# Altium project Air Quality Monitor.PrjPcb (part 1 of 2)
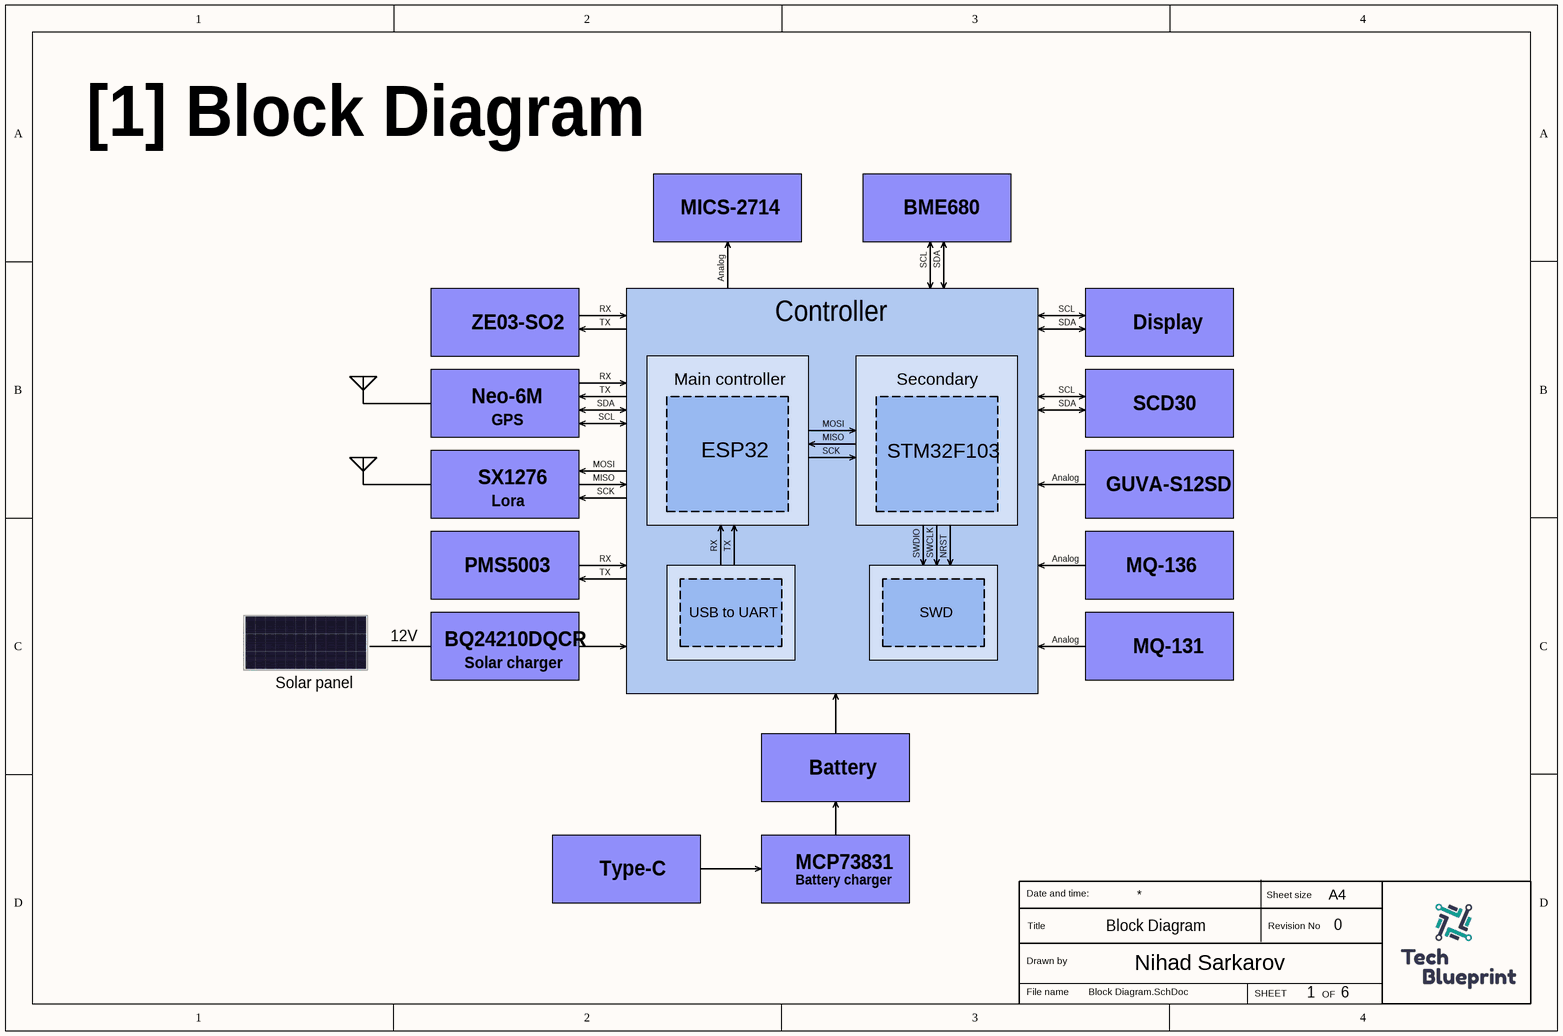
[diagram p0: Block Diagram.SchDoc]
5 sheets, 132 parts. Net scope: flat (ports and power ports of the same name join across sheets).
Board file: PCB.PcbDoc
Sheets:
  Block Diagram.SchDoc
  MCU.SchDoc
  Lora.SchDoc
  GPS.SchDoc
  Power.SchDoc

## Sheet Block Diagram.SchDoc
size A4; SheetNumber: 1; SheetTotal: 2

### Notes on the sheet
- [1] Block Diagram
- MICS-2714
- BME680
- RX
- Analog
- SCL
- SDA
- ZE03-SO2
- TX
- Main controller
- Controller
- Secondary
- Display
- Neo-6M
- GPS
- MOSI
- MISO
- SCD30
- SX1276
- Lora
- SCK
- ESP32
- STM32F103
- GUVA-S12SD
- PMS5003
- SWDIO
- SWCLK
- NRST
- MQ-136
- 12V
- BQ24210DQCR
- USB to UART
- SWD
- MQ-131
- Solar panel
- Solar charger
- Battery
- Type-C
- MCP73831
- Battery charger
- Block Diagram
- 0
- 1
- 6
- Date and time:
- Title
- Sheet size
- Revision No
- A4
- Drawn by
- File name
- Nihad Sarkarov
- SHEET
- OF

## Sheet MCU.SchDoc
size A3; SheetNumber: 2; SheetTotal: 6
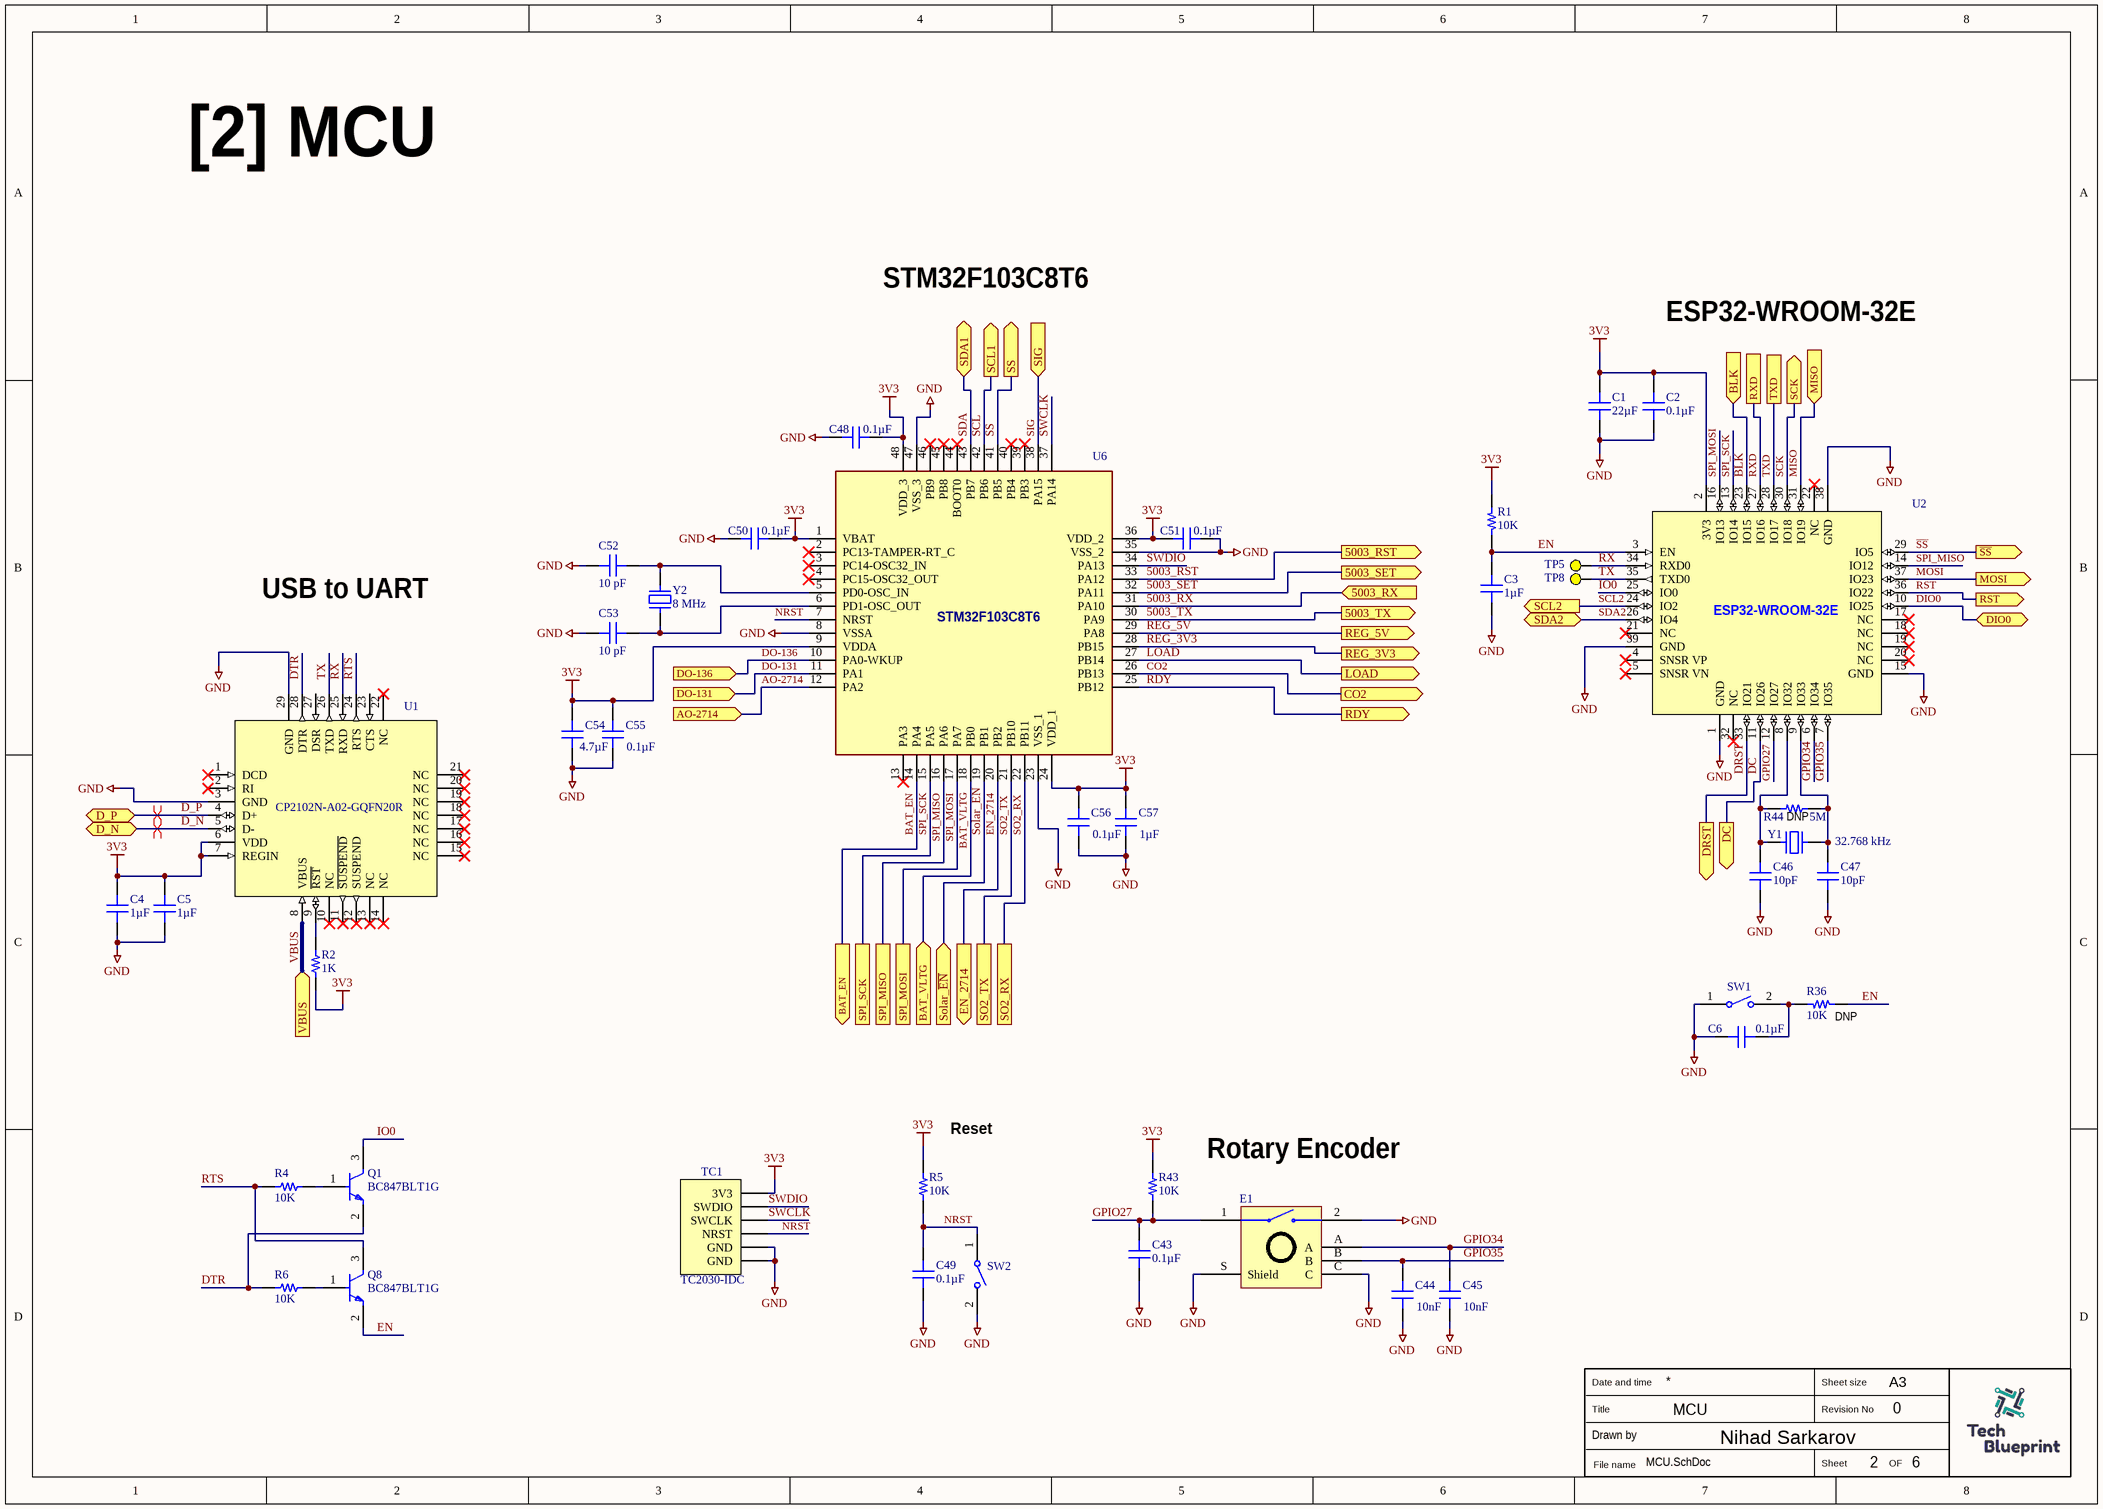
[diagram p1: MCU.SchDoc]

### Parts
C1  22µF  [CAP 0805_2012]
C2  0.1µF  [CAP 0805_2012]
C3  1µF  [CAP 0805_2012]
C4  1µF  [CAP 0805_2012]
C5  1µF  [CAP 0805_2012]
C6  0.1µF  [CAP 0805_2012]
C43  0.1µF  [CAP 0603_1608]
C44  Capacitance: 10nF  [CAP 0603_1608]  (hidden comment: 10000 pF)
C45  Capacitance: 10nF  [CAP 0603_1608]  (hidden comment: 10000 pF)
C46  10pF  [CAP 0603_1608]
C47  10pF  [CAP 0603_1608]
C48  0.1µF  [CAP 0805_2012]
C49  0.1µF  [CAP 0603_1608]
C50  0.1µF  [CAP 0805_2012]
C51  0.1µF  [CAP 0805_2012]
C52  10 pF  [CAP 0603_1608]
C53  10 pF  [CAP 0603_1608]
C54  4.7µF  [CAP 0805_2012]
C55  0.1µF  [CAP 0805_2012]
C56  0.1µF  [CAP 0805_2012]
C57  1µF  [CAP 0805_2012]
E1  PEC11R-4315F-S0012  [BOURNS PEC11R-4315F-S0012]  (value not drawn)
Q1  BC847BLT1G  [ON_Semi_318-08_MFG]
Q8  BC847BLT1G  [ON_Semi_318-08_MFG]
R1  10K  [RES 0805_2012]
R2  1K  [RES 0805_2012]
R4  10K  [RES 0603_1608]
R5  10K  [RES 0603_1608]
R6  10K  [RES 0603_1608]
R36  10K  [RES 0805_2012]
R43  10K  [RES 0603_1608]
R44  5M  [RES 0603_1608]
SW1  FSMSMTR  [TECO-FSMSMTR_V]  (value not drawn)
SW2  FSMSMTR  [TECO-FSMSMTR_V]  (value not drawn)
TC1  TC2030-IDC  [TC2030-IDC]
TP5  Test point  [Test point]  (value not drawn)
TP8  Test point  [Test point]  (value not drawn)
U1  CP2102N-A02-GQFN20R  [QFN50P500X500X100-29N]
U2  ESP32-WROOM-32E(M113EH3200PH3Q0)  [FP-ESP32-WROOM-32E_M113EH-MFG]  (value not drawn)
U6  STM32F103C8T6  [LQFP-48_19.6_393_58X11_SMD]
Y1  32.768 kHz  [ABRACON ABS07]
Y2  8 MHz  [NDK NX3225GD]

### Ports
5003_RST (out, see Sensors[7B]), 5003_RX (in, see Sensors[7B]), 5003_SET (out, see Sensors[7B]), 5003_TX (out, see Sensors[7B]), AO-2714 (in, see Sensors[8C]), BAT_EN (out, see Power[4B]), BAT_VLTG (in, see Power[5B]), BLK (in, see Sensors[3D]), CO2 (out, see Sensors[3B]), D_N (bidir, see Power[1B]), D_P (bidir, see Power[1B]), DC (out, see Sensors[3D]), DIO0 (bidir, see Lora[3B]), DO-131 (in, see Sensors[3B]), DO-136 (in, see Sensors[2B]), DRST (out, see Sensors[2D]), EN_2714 (out, see Sensors[5C]), LOAD (out, see Sensors[4D]), MISO (in, see Lora[2C]), MOSI (out, see Lora[2C]), RDY (out, see Sensors[3C]), REG_3V3 (out, see Power[6C]), REG_5V (out, see Power[6D]), RST (out, see Lora[2B]), RXD (see GPS[3B]), SCK (out, see Lora[2B]), SCL1 (out, see Sensors[4C]), SCL2 (out, see GPS[3B], Sensors[2D]), SDA1 (bidir, see Sensors[4C]), SDA2 (bidir, see GPS[3B], Sensors[2D]), SIG (in, see Sensors[6B]), SO2_RX (see Sensors[4B]), SO2_TX (see Sensors[4B]), Solar_~{EN} (in, see Power[2C]), SPI_MISO, SPI_MOSI, SPI_SCK, SS (out, see Power[6C]), TXD (see GPS[3B]), VBUS (in, see Power[3A]), ~{SS} (out, see Lora[2C])

### Nets
3V3: C1.2 C2.2 C4.2 C5.2 C48.2 C50.2 C51.1 C54.2 C55.2 C56.2 C57.2 R1.2 R2.1 R5.2 R43.2 TC1.6(3V3) U1.6(VDD) U1.7(REGIN) U2.2(3V3) U6.1(VBAT) U6.9(VDDA) U6.24(VDD_1) U6.36(VDD_2) U6.48(VDD_3)
GND: C1.1 C2.1 C3.1 C4.1 C5.1 C6.2 C43.1 C44.1 C45.1 C46.1 C47.1 C48.1 C49.1 C50.1 C51.2 C52.1 C53.1 C54.1 C55.1 C56.1 C57.1 E1.2 E1.C E1.S(Shield) SW1.1 SW2.2 TC1.2(GND) TC1.4(GND) U1.3(GND) U1.29(GND) U2.1(GND) U2.15(GND) U2.38(GND) U2.39(GND) U6.8(VSSA) U6.23(VSS_1) U6.35(VSS_2) U6.47(VSS_3)
5003_RST: U6.33(PA12) ; port 5003_RST
5003_RX: U6.31(PA10) ; port 5003_RX
5003_SET: U6.32(PA11) ; port 5003_SET
5003_TX: U6.30(PA9) ; port 5003_TX
AO-2714: U6.12(PA2) ; port AO-2714
BAT_EN: U6.14(PA4) ; port BAT_EN
BAT_VLTG: U6.18(PB0) ; port BAT_VLTG
BLK: U2.23(IO15) ; port BLK
CO2: U6.26(PB13) ; port CO2
D_N: U1.5(D-) ; port D_N
D_P: U1.4(D+) ; port D_P
DC: U2.11(IO26) ; port DC
DIO0: U2.10(IO25) ; port DIO0
DO-131: U6.11(PA1) ; port DO-131
DO-136: U6.10(PA0-WKUP) ; port DO-136
DRST: U2.33(IO21) ; port DRST
DTR: Q1.2(E) R6.2 U1.28(DTR)
EN: C3.2 Q8.2(E) R1.1 R36.1 U2.3(EN)
EN_2714: U6.20(PB2) ; port EN_2714
GPIO27: C43.2 E1.1 R43.1 U2.12(IO27)
GPIO34: C45.2 E1.A U2.6(IO34)
GPIO35: C44.2 E1.B U2.7(IO35)
IO0: Q1.3(C) U2.25(IO0)
LOAD: U6.27(PB14) ; port LOAD
MISO: U2.31(IO19) ; port MISO
MOSI: U2.37(IO23) ; port MOSI
NRST: C49.2 R5.1 SW2.1 TC1.5(NRST) U6.7(NRST)
RDY: U6.25(PB12) ; port RDY
REG_3V3: U6.28(PB15) ; port REG_3V3
REG_5V: U6.29(PA8) ; port REG_5V
RST: U2.36(IO22) ; port RST
RTS: Q8.3(C) R4.2 U1.24(RTS)
RX: TP5.1 U1.25(RXD) U2.34(RXD0)
RXD: U2.27(IO16) ; port RXD
~{SS}: U2.29(IO5) ; port ~{SS}
SCK: U2.30(IO18) ; port SCK
SCL: U6.42(PB6) ; port SCL1
SCL2: U2.24(IO2) ; port SCL2
SDA: U6.43(PB7) ; port SDA1
SDA2: U2.26(IO4) ; port SDA2
SIG: U6.38(PA15) ; port SIG
SO2_RX: U6.22(PB11) ; port SO2_RX
SO2_TX: U6.21(PB10) ; port SO2_TX
Solar_~{EN}: U6.19(PB1) ; port Solar_~{EN}
SPI_MISO: U2.14(IO12) U6.16(PA6) ; port SPI_MISO
SPI_MOSI: U2.16(IO13) U6.17(PA7) ; port SPI_MOSI
SPI_SCK: U2.13(IO14) U6.15(PA5) ; port SPI_SCK
SS: U6.41(PB5) ; port SS
SWCLK: TC1.3(SWCLK) U6.37(PA14)
SWDIO: TC1.1(SWDIO) U6.34(PA13)
TX: TP8.1 U1.26(TXD) U2.35(TXD0)
TXD: U2.28(IO17) ; port TXD
VBUS: U1.8(VBUS) ; port VBUS
NetC6_1: C6.1 R36.2 SW1.2
NetC46_2: C46.2 R44.1 U2.8(IO32) Y1.2
NetC47_2: C47.2 R44.2 U2.9(IO33) Y1.1
NetC52_2: C52.2 U6.5(PD0-OSC_IN) Y2.2
NetC53_2: C53.2 U6.6(PD1-OSC_OUT) Y2.1
NetQ1_1: Q1.1(B) R4.1
NetQ8_1: Q8.1(B) R6.1
NetR2_2: R2.2 U1.9(~{RST})

Not connected (* = marked no-connect by the designer): U1 1(DCD)* 2(RI)* 10(NC)* 11(~{SUSPEND})* 12(SUSPEND)* 13(NC)* 14(NC)* 15(NC)* 16(NC)* 17(NC)* 18(NC)* 19(NC)* 20(NC)* 21(NC)* 22(NC)* 23(CTS) 27(DSR); U2 4(SNSR_VP)* 5(SNSR_VN)* 17(NC)* 18(NC)* 19(NC)* 20(NC)* 21(NC)* 22(NC)* 32(NC)*; U6 2(PC13-TAMPER-RT_C)* 3(PC14-OSC32_IN)* 4(PC15-OSC32_OUT)* 13(PA3)* 39(PB3)* 40(PB4)* 44(BOOT0)* 45(PB8)* 46(PB9)*

### Layout directives
differential pair; differential pair class USB_90: D_N, D_P

### Notes on the sheet
- [2] MCU
- STM32F103C8T6
- ESP32-WROOM-32E
- USB to UART
- (near R44) DNP
- (near R36) DNP
- (near R5) Reset
- Rotary Encoder
- MCU
- 0
- 2
- 6
- Date and time
- Sheet size
- A3
- Title
- Drawn by
- File name
- Nihad Sarkarov
- Sheet
- Revision No
- OF
- (in symbol CMP-194065-000012-1) ESP32-WROOM-32E

### Library data of the parts
C1 = 08056D226KAT2A: CAP CER 22UF 6.3V X5R 0805; manufacturer: AVX Corporation; Tolerance: ±10%; Part Number: 08056D226KAT2A; Capacitance: 22µF; Applications: General Purpose; componentlink1description: Datasheet; componentlink1url: http://datasheets.avx.com/cx5r.pdf; componentlink2description: DigiKey Link; componentlink2url: http://digikey.com/product-detail/en/avx-corporation/08056D226KAT2A/478-10069-1-ND/6564291; Device Package: 0805 (2012 Metric); lastupdated: 9/2/2020 1:04:40 AM; Lifecycle Status: Active; Minimum Order: 1; Mounting Type: Surface Mount, MLCC; Operating Temperature: -55°C ~ 85°C; Package / Case: 0805 (2012 Metric); packaging: TapeAndReel; partid: 3404; Part Status: Active; price: 0.18; series: -; Size / Dimension: 0.079" L x 0.049" W (2.01mm x 1.25mm); Supplier 1: DigiKey; Supplier Part Number 1: 478-10069-1-ND; Temperature Coefficient: X5R; Thickness (Max): 0.060" (1.52mm); value: 22µF; Voltage - Rated: 6.3V
C2 C6 = 08053C104KAT4A: CAP CER 0.1UF 25V X7R 0805; manufacturer: AVX Corporation; Tolerance: ±10%; Part Number: 08053C104KAT4A; Capacitance: 0.1µF; Applications: General Purpose; componentlink1description: Datasheet; componentlink1url: http://datasheets.avx.com/X7RDielectric.pdf; componentlink2description: DigiKey Link; componentlink2url: http://digikey.com/product-detail/en/avx-corporation/08053C104KAT4A/478-13052-1-ND/9948570; Device Package: 0805 (2012 Metric); lastupdated: 9/2/2020 1:04:37 AM; Lifecycle Status: Active; Minimum Order: 1; Mounting Type: Surface Mount, MLCC; Operating Temperature: -55°C ~ 125°C; Package / Case: 0805 (2012 Metric); packaging: TapeAndReel; partid: 5333; Part Status: Active; price: 0.02; series: -; Size / Dimension: 0.079" L x 0.049" W (2.01mm x 1.25mm); Supplier 1: DigiKey; Supplier Part Number 1: 478-13052-1-ND; Temperature Coefficient: X7R; Thickness (Max): 0.037" (0.94mm); value: 0.1µF; Voltage - Rated: 25V
C3-C5 = LGC26D105MAT2S1: CAP CER 1UF 6.3V X5R 0805; manufacturer: AVX Corporation; Tolerance: ±20%; Part Number: LGC26D105MAT2S1; Capacitance: 1µF; Applications: Bypass, Decoupling; componentlink1description: Datasheet; componentlink1url: http://datasheets.avx.com/LGA.pdf; componentlink2description: DigiKey Link; componentlink2url: http://digikey.com/product-detail/en/avx-corporation/LGC26D105MAT2S1/478-6694-1-ND/2694148; Device Package: 0805 (2012 Metric); Features: Low ESL (Multi-Terminal); lastupdated: 9/2/2020 1:04:42 AM; Lifecycle Status: Active; Minimum Order: 1; Mounting Type: Surface Mount, MLCC; Operating Temperature: -55°C ~ 85°C; Package / Case: 0805 (2012 Metric); packaging: TapeAndReel; partid: 2463; Part Status: Active; price: 0.63; series: LGC2 (LGA); Size / Dimension: 0.081" L x 0.052" W (2.06mm x 1.32mm); Supplier 1: DigiKey; Supplier Part Number 1: 478-6694-1-ND; Temperature Coefficient: X5R; Thickness (Max): 0.022" (0.55mm); value: 1µF; Voltage - Rated: 6.3V
C43 C49 = 06033C104K4T4A: CAP CER 0.1UF 25V X7R 0603; manufacturer: AVX Corporation; Tolerance: ±10%; Part Number: 06033C104K4T4A; Capacitance: 0.1µF; Applications: Automotive; componentlink1description: Datasheet; componentlink1url: http://datasheets.avx.com/AutoMLCC.pdf; componentlink2description: DigiKey Link; componentlink2url: http://digikey.com/product-detail/en/avx-corporation/06033C104K4T4A/478-10673-1-ND/7536544; Device Package: 0603 (1608 Metric); lastupdated: 9/2/2020 1:03:35 AM; Lifecycle Status: Active; Minimum Order: 1; Mounting Type: Surface Mount, MLCC; Operating Temperature: -55°C ~ 125°C; Package / Case: 0603 (1608 Metric); packaging: TapeAndReel; partid: 2749; Part Status: Active; price: 0.02; Ratings: AEC-Q200; series: -; Size / Dimension: 0.063" L x 0.032" W (1.60mm x 0.81mm); Supplier 1: DigiKey; Supplier Part Number 1: 478-10673-1-ND; Temperature Coefficient: X7R; Thickness (Max): 0.035" (0.90mm); value: 0.1µF; Voltage - Rated: 25V
C44 C45 = C0603C103K4RECAUTO: CAP CER 0603 10NF 16V X7R 10%; manufacturer: KEMET; Part Number: C0603C103K4RECAUTO; Applications: Automotive, ESD Protection; componentlink1description: Datasheet; componentlink1url: https://api.kemet.com/component-edge/download/datasheet/C0603C103K4RECAUTO.pdf; componentlink2description: DigiKey Link; componentlink2url: https://www.digikey.com/en/products/detail/kemet/C0603C103K4RECAUTO/8640474; Device Package: 0603 (1608 Metric); lastupdated: 2/9/2024 8:10:22 PM; Lifecycle Status: Active; Minimum Order: 1; Mounting Type: Surface Mount, MLCC; Operating Temperature: -55°C ~ 125°C; Package / Case: 0603 (1608 Metric); packaging: TapeAndReel; partid: 8251; Part Status: Active; price: 0.01; Ratings: AEC-Q200; series: ESD SMD Auto X7R; Size / Dimension: 0.063" L x 0.031" W (1.60mm x 0.80mm); Supplier 1: DigiKey; Supplier Part Number 1: 399-17880-1-ND; Temperature Coefficient: X7R; Thickness (Max): 0.034" (0.87mm); Tolerance: ±10%; value: 10000 pF; Voltage - Rated: 16V
C46 C47 = 06035A100J4T2A: CAP CER 10PF 50V NP0 0603; manufacturer: AVX Corporation; Temperature Coefficient: C0G, NP0; Tolerance: ±5%; Part Number: 06035A100J4T2A; Capacitance: 10pF; Applications: Automotive; componentlink1description: Datasheet; componentlink1url: http://datasheets.avx.com/AutoMLCC.pdf; componentlink2description: DigiKey Link; componentlink2url: http://digikey.com/product-detail/en/avx-corporation/06035A100J4T2A/478-11607-1-ND/8564165; Device Package: 0603 (1608 Metric); lastupdated: 9/2/2020 1:03:34 AM; Lifecycle Status: Active; Minimum Order: 1; Mounting Type: Surface Mount, MLCC; Operating Temperature: -55°C ~ 125°C; Package / Case: 0603 (1608 Metric); packaging: TapeAndReel; partid: 3073; Part Status: Active; price: 0.04; Ratings: AEC-Q200; series: -; Size / Dimension: 0.063" L x 0.031" W (1.60mm x 0.80mm); Supplier 1: DigiKey; Supplier Part Number 1: 478-11607-1-ND; Thickness (Max): 0.035" (0.90mm); value: 10pF; Voltage - Rated: 50V
C48 C50 C51 C55 C56 = 08053C104K4Z2A: CAP CER 0.1UF 25V X7R 0805; manufacturer: AVX Corporation; Tolerance: ±10%; Part Number: 08053C104K4Z2A; Capacitance: 0.1µF; Applications: Automotive, Boardflex Sensitive; componentlink1description: Datasheet; componentlink1url: http://datasheets.avx.com/FlexitermMLCC.pdf; componentlink2description: DigiKey Link; componentlink2url: http://digikey.com/product-detail/en/avx-corporation/08053C104K4Z2A/478-12768-1-ND/9949470; Device Package: 0805 (2012 Metric); Features: Soft Termination; lastupdated: 9/2/2020 1:04:37 AM; Lifecycle Status: Active; Minimum Order: 1; Mounting Type: Surface Mount, MLCC; Operating Temperature: -55°C ~ 125°C; Package / Case: 0805 (2012 Metric); packaging: TapeAndReel; partid: 5455; Part Status: Active; price: 0.07; Ratings: AEC-Q200; series: FLEXITERM®; Size / Dimension: 0.079" L x 0.049" W (2.01mm x 1.25mm); Supplier 1: DigiKey; Supplier Part Number 1: 478-12768-1-ND; Temperature Coefficient: X7R; Thickness (Max): 0.037" (0.94mm); value: 0.1µF; Voltage - Rated: 25V
C52 C53 = 500X14N100MV4T: CAP CER 10PF 50V C0G/NP0 0603; manufacturer: Johanson Dielectrics Inc.; Temperature Coefficient: C0G, NP0; Tolerance: ±20%; Part Number: 500X14N100MV4T; Capacitance: 10 pF; Applications: Bypass, Decoupling; componentlink1description: Datasheet; componentlink1url: https://www.johansondielectrics.com/downloads/x2y-filter-and-decoupling-capacitors.pdf; componentlink2description: DigiKey Link; componentlink2url: https://www.digikey.com/en/products/detail/johanson-dielectrics-inc/500X14N100MV4T/1556323; Device Package: 0603 (1608 Metric); Features: Low ESL (X2Y); lastupdated: 2/9/2024 8:10:26 PM; Lifecycle Status: Active; Minimum Order: 1; Mounting Type: Surface Mount, MLCC; Operating Temperature: -55°C ~ 125°C; Package / Case: 0603 (1608 Metric); packaging: TapeAndReel; partid: 5927; Part Status: Active; price: 0.06; series: X2Y®; Size / Dimension: 0.064" L x 0.035" W (1.63mm x 0.89mm); Supplier 1: DigiKey; Supplier Part Number 1: 709-1001-1-ND; Thickness (Max): 0.026" (0.66mm); value: 10 pF; Voltage - Rated: 50V
C54 = 0805ZD475KAT2A: CAP CER 4.7UF 10V X5R 0805; manufacturer: AVX Corporation; Tolerance: ±10%; Part Number: 0805ZD475KAT2A; Capacitance: 4.7µF; Applications: General Purpose; componentlink1description: Datasheet; componentlink1url: http://datasheets.avx.com/cx5r.pdf; componentlink2description: DigiKey Link; componentlink2url: http://digikey.com/product-detail/en/avx-corporation/0805ZD475KAT2A/478-1415-1-ND/564447; Device Package: 0805 (2012 Metric); lastupdated: 9/2/2020 1:04:40 AM; Lifecycle Status: Active; Minimum Order: 1; Mounting Type: Surface Mount, MLCC; Operating Temperature: -55°C ~ 85°C; Package / Case: 0805 (2012 Metric); packaging: TapeAndReel; partid: 3139; Part Status: Active; price: 0.12; series: -; Size / Dimension: 0.079" L x 0.049" W (2.01mm x 1.25mm); Supplier 1: DigiKey; Supplier Part Number 1: 478-1415-1-ND; Temperature Coefficient: X5R; Thickness (Max): 0.055" (1.40mm); value: 4.7µF; Voltage - Rated: 10V
C57 = MM05ZC105KCZ2A: CAP CER 1UF 10V X7R 0805; manufacturer: AVX Corporation; Tolerance: ±10%; Part Number: MM05ZC105KCZ2A; Capacitance: 1µF; Applications: Medical, Non-Critical; componentlink1description: Datasheet; componentlink1url: http://datasheets.avx.com/AVX-MM.pdf; componentlink2description: DigiKey Link; componentlink2url: http://digikey.com/product-detail/en/avx-corporation/MM05ZC105KCZ2A/478-10611-1-ND/7344872; Device Package: 0805 (2012 Metric); lastupdated: 9/2/2020 1:04:42 AM; Lifecycle Status: Active; Minimum Order: 1; Mounting Type: Surface Mount, MLCC; Operating Temperature: -55°C ~ 125°C; Package / Case: 0805 (2012 Metric); packaging: TapeAndReel; partid: 2439; Part Status: Active; price: 0.50; series: MM; Size / Dimension: 0.079" L x 0.049" W (2.01mm x 1.25mm); Supplier 1: DigiKey; Supplier Part Number 1: 478-10611-1-ND; Temperature Coefficient: X7R; Thickness (Max): 0.029" (0.74mm); value: 1µF; Voltage - Rated: 10V
E1 = PEC11R-4315F-S0012: ROTARY ENCODER MECHANICAL 12PPR; Manufacturer 1: Bourns; Manufacturer: Bourns Inc.; Output Type: Quadrature (Incremental); Built in Switch: Yes; Number of Channels: 2; Pulses per Revolution: 12; Capacitance: 4315F; Actuator Type: 6mm Dia Flatted End; Rotational Life (Cycles Min): 30K; Supplier 1: DigiKey; Manufacturer Part Number 1: PEC11R-4315F-S0012; Stock 1: 453; Pricing 1: 1=1.91000, 10=1.68200, 25=1.50800, 50=1.45000, 100=1.39200, 250=1.33400, 500=1.10200, 1000=1.04400, 5000=0.87000 (USD); RoHS: Yes; Mount: Through Hole,Panel,PCB; Min Operating Temperature: -30°C; Max Operating Temperature: 70°C; Termination: PC Pin; Packaging: Unknown; Package Quantity: 75; Encoder Type: Mechanical; Detent: Yes; Orientation: Vertical; Length: 21.5mm; Height: 13.4mm; Width: 12.5mm; ComponentLink1URL: https://www.bourns.com/docs/Product-Datasheets/PEC11R.pdf; ComponentLink1Description: Datasheet; ComponentLink2URL: http://digikey.com/product-detail/en/bourns-inc/PEC11R-4315F-S0012/PEC11R-4315F-S0012-ND/4699232; ComponentLink2Description: DigiKey Link; Part Number: PEC11R-4315F-S0012; LastUpdated: 6/25/2020 3:43:12 PM; Lifecycle Status: Active; Minimum Order: 1; Mounting Type: Panel, PCB Through Hole; Part Status: Active; Price: 1.91; Series: PEC11R; Supplier Part Number 1: PEC11R-4315F-S0012-ND; Termination Style: PC Pin
Q1 Q8 = CMP-1048-00759-2: NexarPartId: 129565; Manufacturer Lifecycle Status: ACTIVE; Max Power Dissipation: 300mW; Max Frequency: 100MHz; hFE Min: 200; Collector Base Voltage (VCBO): 50V; Max Collector Current: 100mA; Max Breakdown Voltage: 45V; Collector Emitter Saturation Voltage: 600mV; Number of Elements: 1; Polarity: NPN; Emitter Base Voltage (VEBO): 6V; Max Junction Temperature (Tj): 150°C; Element Configuration: Single; Type: General Purpose; Schedule B: 8541210080; Max Operating Temperature: 150°C; Width: 1.397mm; Radiation Hardening: No; Transition Frequency: 100MHz; Lifecycle Status: Production; Length: 3.0226mm; Collector Emitter Voltage (VCEO): 45V; Halogen Free: Halogen Free; Lead Free: Lead Free; Contact Plating: Tin; Current Rating: 100mA; Gain Bandwidth Product: 100MHz; Number of Pins: 3; REACH SVHC: No SVHC; Packaging: Cut Tape; RoHS: Compliant; Voltage Rating (DC): 45V; Height: 1.016mm; Min Operating Temperature: -55°C; Collector Emitter Breakdown Voltage: 45V; Power Dissipation: 300mW; Case/Package: SOT-23-3; Frequency: 100MHz
R1 R36 = CRGH0805J10K: RES SMD 10K OHM 5% 1/3W 0805; Manufacturer: TE Connectivity Passive Product; Power (Watts): 0.333W, 1/3W; Resistance: 10 kOhms; Temperature Coefficient: ±100ppm/°C; Part Number: CRGH0805J10K; Value: 10K; ComponentLink1Description: Datasheet; ComponentLink1URL: https://www.te.com/commerce/DocumentDelivery/DDEController?Action=srchrtrv&DocNm=1773204-1&DocType=DS&DocLang=English; ComponentLink2Description: DigiKey Link; ComponentLink2URL: https://www.digikey.com/en/products/detail/te-connectivity-passive-product/CRGH0805J10K/2385548; Composition: Thick Film; Device Package: 0805 (2012 Metric); LastUpdated: 2/8/2024 9:02:37 PM; Lifecycle Status: Active; Minimum Order: 1; Number of Terminations: 2; Operating Temperature: -55°C ~ 155°C; Package / Case: 0805 (2012 Metric); Packaging: TapeAndReel; PartId: 28127; Part Status: Active; Price: 0.01; Series: CRGH, Neohm; Size / Dimension: 0.083" L x 0.051" W (2.10mm x 1.30mm); Supplier 1: DigiKey; Supplier Part Number 1: A126429CT-ND; Supplier Device Package: 0805; Tolerance: ±5%
R2 = CRGH0805J1K0: RES SMD 1K OHM 5% 1/3W 0805; Manufacturer: TE Connectivity Passive Product; Power (Watts): 0.333W, 1/3W; Resistance: 1 kOhms; Temperature Coefficient: ±100ppm/°C; Part Number: CRGH0805J1K0; Value: 1K; ComponentLink1Description: Datasheet; ComponentLink1URL: https://www.te.com/commerce/DocumentDelivery/DDEController?Action=srchrtrv&DocNm=1773204-1&DocType=DS&DocLang=English; ComponentLink2Description: DigiKey Link; ComponentLink2URL: https://www.digikey.com/en/products/detail/te-connectivity-passive-product/CRGH0805J1K0/2385524; Composition: Thick Film; Device Package: 0805 (2012 Metric); LastUpdated: 2/8/2024 9:02:37 PM; Lifecycle Status: Active; Minimum Order: 1; Number of Terminations: 2; Operating Temperature: -55°C ~ 155°C; Package / Case: 0805 (2012 Metric); Packaging: TapeAndReel; PartId: 28125; Part Status: Active; Price: 0.01; Series: CRGH, Neohm; Size / Dimension: 0.083" L x 0.051" W (2.10mm x 1.30mm); Supplier 1: DigiKey; Supplier Part Number 1: A126435CT-ND; Supplier Device Package: 0805; Tolerance: ±5%
R4-R6 R43 = CRCW060310K0JNEA: RES SMD 10K OHM 5% 1/10W 0603; Manufacturer: Vishay Dale; Power (Watts): 0.1W, 1/10W; Resistance: 10 kOhms; Temperature Coefficient: ±200ppm/°C; Part Number: CRCW060310K0JNEA; Value: 10K; ComponentLink1Description: Datasheet; ComponentLink1URL: http://www.vishay.com/docs/20035/dcrcwe3.pdf; ComponentLink2Description: DigiKey Link; ComponentLink2URL: https://www.digikey.com/en/products/detail/vishay-dale/CRCW060310K0JNEA/1174253; Composition: Thick Film; Device Package: 0603 (1608 Metric); Features: Automotive AEC-Q200; Height - Seated (Max): 0.020" (0.50mm); LastUpdated: 2/9/2024 8:43:35 PM; Lifecycle Status: Active; Minimum Order: 1; Number of Terminations: 2; Operating Temperature: -55°C ~ 155°C; Package / Case: 0603 (1608 Metric); Packaging: CutTape; PartId: 5216; Part Status: Active; Price: 0.01; Ratings: AEC-Q200; Series: CRCW; Size / Dimension: 0.063" L x 0.033" W (1.60mm x 0.85mm); Supplier 1: DigiKey; Supplier Part Number 1: 541-10KGCT-ND; Supplier Device Package: 0603; Tolerance: ±5%
R44 = HVC0603T5004FET: RES SMD 5M OHM 1% 1/10W 0603; Manufacturer: Ohmite; Power (Watts): 0.1W, 1/10W; Resistance: 5 MOhms; Temperature Coefficient: ±100ppm/°C; Part Number: HVC0603T5004FET; Value: 5M; ComponentLink1Description: Datasheet; ComponentLink1URL: http://www.ohmite.com/assets/docs/res_hvc.pdf?r=false; ComponentLink2Description: DigiKey Link; ComponentLink2URL: https://www.digikey.com/en/products/detail/ohmite/HVC0603T5004FET/4759723; Composition: Thick Film; Device Package: 0603 (1608 Metric); Features: High Voltage; Height - Seated (Max): 0.022" (0.55mm); LastUpdated: 2/9/2024 8:42:42 PM; Lifecycle Status: Active; Minimum Order: 1; Number of Terminations: 2; Operating Temperature: -55°C ~ 155°C; Package / Case: 0603 (1608 Metric); Packaging: TapeAndReel; PartId: 18926; Part Status: Active; Price: 0.49; Series: HVC; Size / Dimension: 0.059" L x 0.031" W (1.50mm x 0.80mm); Supplier 1: DigiKey; Supplier Part Number 1: HVC0603T5004FETCT-ND; Supplier Device Package: 0603; Tolerance: ±1%
SW1 SW2 = CMP-2000-07501-1: FSMSM Push Button Switch, 50 mA, -35 to 85 degC, 2-Pin SMD, RoHS, Tape and Reel; Manufacturer: TE Connectivity; Voltage Rating (DC): 24V; Electrical Life: 20000Cycles; Operating Force: 180gf; Switch Travel: 0.25mm; Contact Current Rating: 50mA; Case\/Package: SMD/SMT; Actuator Length: 1.07mm; Throw Configuration: SPST; Actuator Material: Polyamide; Contact Resistance: 100mOhm; Illumination Type: Illuminated; Max Voltage Rating (DC): 12V; Manufacturer URL: http://www.te.com/; Lead Free: LeadFree; Packaging: TapeandReel; Min Operating Temperature: -35degC; Mechanical Life: 20000Cycles; Mount: SurfaceMount; REACH SVHC: Unknown; Package Quantity: 1800; Package Reference: FSMSMTR; RoHSCompliant: true; Max Operating Temperature: 85degC; Orientation: Straight; ELV: Compliant; Datasheet URL: http://www.te.com/commerce/DocumentDelivery/DDEController?Action=showdoc&DocId=Customer+Drawing%7F1437566-3%7FC2%7Fpdf%7FEnglish%7FENG_CD_1437566-3_C2_1437566_3_1_c.dwg.pdf%7F1437566-4; Package Description: 2-Pin Surface Mount Device, Body 6 x 3.5 mm, Pitch 9.19 mm; Current Rating: 50mA; Contact Plating: Silver; Termination: GullWing; Datasheet Version: Rev. C2, 08/2014; Contact Material: Brass; Mounting Technology: SurfaceMount
TC1 = TC2030-IDC: PLUG-OF-NAILS 6-PIN W/ LEGS 8; MF: Tag-Connect LLC; SnapEDA_Link: https://www.snapeda.com/parts/TC2030-IDC/Tag-Connect/view-part/?ref=snap; Package: None; MP: TC2030-IDC; Check_prices: https://www.snapeda.com/parts/TC2030-IDC/Tag-Connect/view-part/?ref=eda; Value: *
TP5 TP8 = Test point: 1mm x 1mm round pad for testing purposes
U1 = CP2102: USB Bridge, USB to UART USB 2.0 UART Interface 20-QFN (3x3); MF: {'manufacturer': u'Silicon Labs'}; Package: None; Price: None; Value: *; MP: CP2102; Availability: Unavailable; Supplier 1: Digikey; Supplier Part Number 1: 336-5886-1-ND
U2 = CMP-194065-000012-1: RX TXRX MOD WIFI TRACE ANT SMD; Supplier 1: Digikey; Supplier Part Number 1: 1904-ESP32-WROOM-32E(M113EH3200PH3Q0)TR-ND
U6 = IC_STM32F103C8T6: ARM® Cortex®-M3 STM32F1 Microcontroller IC 32-Bit 72MHz 64KB (64K x 8) FLASH 48-LQFP (7x7); Manufacturer: STMicroelectronics; Alternate Part Number-1: NA; Manufacturer Part Number: STM32F103C8T6; Case/Package: LQFP48; Supplier-1: LCSC; Supplier Part Number-1: STM32F103C8T6
Y1 = ABS07-32.768KHZ-7-T: CRYSTAL 32.7680KHZ 7PF SMD; Manufacturer: Abracon LLC; ESR (Equivalent Series Resistance): 70 kOhms; Frequency Tolerance: ±20ppm; Operating Mode: Fundamental; Part Number: ABS07-32.768KHZ-7-T; ComponentLink1Description: Datasheet; ComponentLink1URL: https://abracon.com/Resonators/ABS07.pdf; ComponentLink2Description: DigiKey Link; ComponentLink2URL: https://www.digikey.com/en/products/detail/abracon-llc/ABS07-32-768KHZ-7-T/1236859; Frequency: 32.768 kHz; Height - Seated (Max): 0.035" (0.90mm); LastUpdated: 6/3/2024 8:02:04 PM; Lifecycle Status: Active; Load Capacitance: 7pF; Minimum Order: 1; Mounting Type: Surface Mount; Operating Temperature: -40°C ~ 85°C; Package / Case: 2-SMD, No Lead; Packaging: TapeAndReel; PartId: 377; Part Status: Active; Price: 0.44; Series: ABS07; Size / Dimension: 0.126" L x 0.059" W (3.20mm x 1.50mm); Supplier 1: DigiKey; Supplier Part Number 1: 535-9543-1-ND; Type: kHz Crystal (Tuning Fork); Value: 32.768 kHz
Y2 = CG04874-8M: CRYSTAL 8.0000MHZ 8PF SMD; Manufacturer: NDK America, Inc.; ESR (Equivalent Series Resistance): 500 Ohms; Frequency Stability: ±50ppm; Frequency Tolerance: ±20ppm; Operating Mode: Fundamental; Part Number: CG04874-8M; ComponentLink1Description: Datasheet; ComponentLink1URL: https://www.ndk.com/images/products/catalog/c_NX3225GD_e.pdf; ComponentLink2Description: DigiKey Link; ComponentLink2URL: https://www.digikey.com/en/products/detail/ndk-america-inc/CG04874-8M/9172047; Frequency: 8 MHz; Height - Seated (Max): 0.039" (1.00mm); LastUpdated: 6/3/2024 8:17:11 PM; Lifecycle Status: Active; Load Capacitance: 8pF; Minimum Order: 1; Mounting Type: Surface Mount; Operating Temperature: -40°C ~ 85°C; Packaging: TapeAndReel; PartId: 1002; Price: 0.37; Ratings: AEC-Q200; Series: NX3225GD; Size / Dimension: 0.126" L x 0.098" W (3.20mm x 2.50mm); Supplier 1: DigiKey; Supplier Part Number 1: 644-CG04874-8MCT-ND; Type: MHz Crystal; Value: 8 MHz

## Sheet Lora.SchDoc
size A4; SheetNumber: 4; SheetTotal: 6
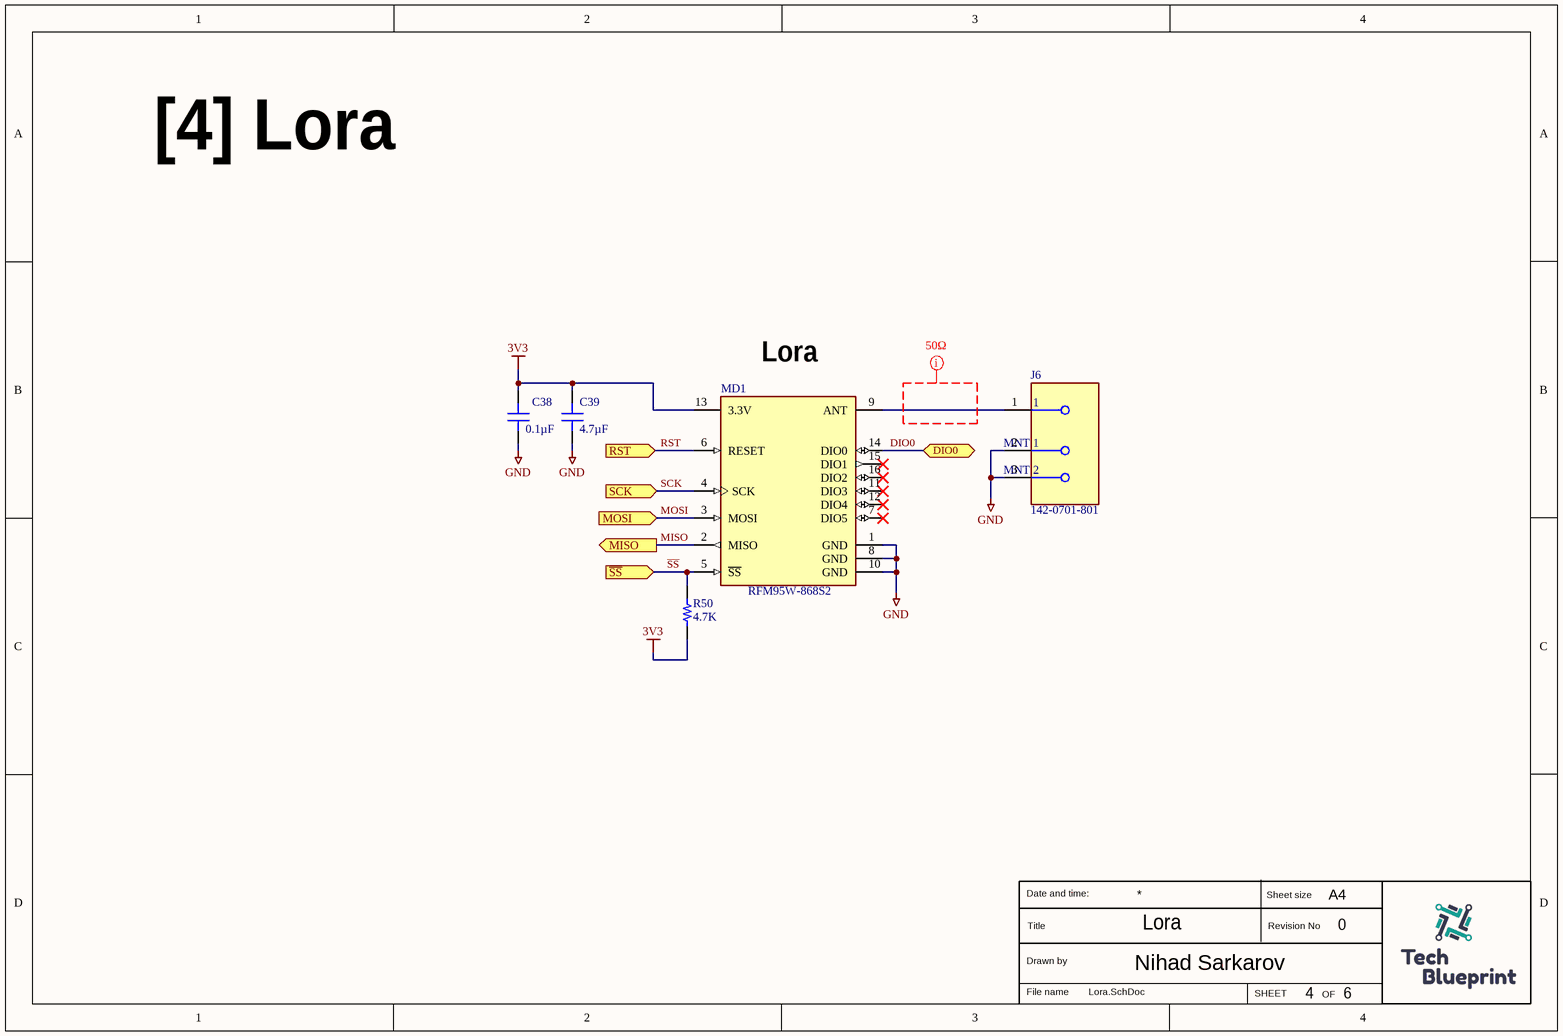
[diagram p2: Lora.SchDoc]

### Parts
C38  0.1µF  [CAP 0805_2012]
C39  4.7µF  [CAP 0805_2012]
J6  142-0701-801  [FP-142-0701-801-MFG]
MD1  RFM95W-868S2  [FP-RFM95W-868S2-MFG]
R50  4.7K  [KOA RES RK73 RN73 0603_1608]

### Ports
DIO0 (bidir, see MCU[8B]), MISO (out, see MCU[7B]), MOSI (in, see MCU[8B]), RST (in, see MCU[8B]), SCK (in, see MCU[7B]), ~{SS} (in, see MCU[8B])

### Nets
3V3: C38.2 C39.2 MD1.13(3.3V) R50.1
GND: C38.1 C39.1 J6.2(MNT_1) J6.3(MNT_2) MD1.1(GND) MD1.8(GND) MD1.10(GND)
DIO0: MD1.14(DIO0) ; port DIO0
MISO: MD1.2(MISO) ; port MISO
MOSI: MD1.3(MOSI) ; port MOSI
RST: MD1.6(RESET) ; port RST
~{SS}: MD1.5(~{SS}) R50.2 ; port ~{SS}
SCK: MD1.4(SCK) ; port SCK
NetJ6_1: J6.1 MD1.9(ANT)

Not connected (* = marked no-connect by the designer): MD1 7(DIO5)* 11(DIO3)* 12(DIO4)* 15(DIO1)* 16(DIO2)*

### Layout directives
net class RF_50Ω: (no net found under the mark)

### Notes on the sheet
- [4] Lora
- (near MD1) Lora
- Lora
- 0
- 4
- 6
- Date and time:
- Title
- Sheet size
- Revision No
- A4
- Drawn by
- File name
- Nihad Sarkarov
- SHEET
- OF

### Library data of the parts
C38 = 08053C104KAT4A: as C2 on sheet MCU; Part Number: 08053C104KAT4A; Capacitance: 0.1µF; Applications: General Purpose; componentlink1description: Datasheet; componentlink1url: http://datasheets.avx.com/X7RDielectric.pdf; componentlink2description: DigiKey Link; componentlink2url: http://digikey.com/product-detail/en/avx-corporation/08053C104KAT4A/478-13052-1-ND/9948570; Device Package: 0805 (2012 Metric); lastupdated: 9/2/2020 1:04:37 AM; Lifecycle Status: Active; Minimum Order: 1; Mounting Type: Surface Mount, MLCC; Operating Temperature: -55°C ~ 125°C; Package / Case: 0805 (2012 Metric); packaging: TapeAndReel; partid: 5333; Part Status: Active; price: 0.02; series: -; Size / Dimension: 0.079" L x 0.049" W (2.01mm x 1.25mm); Supplier 1: DigiKey; Supplier Part Number 1: 478-13052-1-ND; Temperature Coefficient: X7R; Thickness (Max): 0.037" (0.94mm); value: 0.1µF; Voltage - Rated: 25V
C39 = 0805ZD475KAT2A: as C54 on sheet MCU; Part Number: 0805ZD475KAT2A; Capacitance: 4.7µF; Applications: General Purpose; componentlink1description: Datasheet; componentlink1url: http://datasheets.avx.com/cx5r.pdf; componentlink2description: DigiKey Link; componentlink2url: http://digikey.com/product-detail/en/avx-corporation/0805ZD475KAT2A/478-1415-1-ND/564447; Device Package: 0805 (2012 Metric); lastupdated: 9/2/2020 1:04:40 AM; Lifecycle Status: Active; Minimum Order: 1; Mounting Type: Surface Mount, MLCC; Operating Temperature: -55°C ~ 85°C; Package / Case: 0805 (2012 Metric); packaging: TapeAndReel; partid: 3139; Part Status: Active; price: 0.12; series: -; Size / Dimension: 0.079" L x 0.049" W (2.01mm x 1.25mm); Supplier 1: DigiKey; Supplier Part Number 1: 478-1415-1-ND; Temperature Coefficient: X5R; Thickness (Max): 0.055" (1.40mm); value: 4.7µF; Voltage - Rated: 10V
J6 = CMP-09588-000002-1: CONN SMA JACK STR 50OHM EDGE MNT; Frequency: 18GHz; Operating Frequency: 0 to 18 GHz; Body Material: Brass; Impedance: 50R; Voltage Rating: 335V; Gender: Female; Body Plating: Gold; Orientation: Straight; Length: 0.44inch; Max Operating Temperature: 165°C; Package Quantity: 5; Packaging: Bulk; Series: SMA; Contact Material: Copper; Min Operating Temperature: -65°C; Depth: 25.58mm; RoHS Compliant: Yes; Case/Package: SMA; Max Frequency: 18GHz; Radiation Hardening: No; Contact Plating: Gold; Mount: Edge; Connector Type: SMA; Fastening Type: Threaded; Termination: Solder
MD1 = CMP-204316-000001-1: RX TXRX MODULE ISM < 1GHZ SMD; Data Rate: 300Kbps; Frequency: 868MHz; Sensitivity: -123dBm; Interface: SPI; Current - Transmitting: 120mA; Current - Receiving: 12.1mA; Max Operating Temperature: 70°C; Case/Package: SMD/SMT; Packaging: Bulk; Mount: Surface Mount; Min Operating Temperature: -20°C
R50 = RK73B1JTTD472J: RES 4.7K OHM 5% 1/10W 0603; Manufacturer: KOA Speer Electronics, Inc.; Power (Watts): 0.1W, 1/10W; Resistance: 4.7 kOhms; Temperature Coefficient: ±200ppm/°C; Part Number: RK73B1JTTD472J; Value: 4.7K; ComponentLink1Description: Datasheet; ComponentLink1URL: http://www.koaspeer.com/catimages/Products/RK73B/RK73B.pdf; ComponentLink2Description: DigiKey Link; ComponentLink2URL: https://www.digikey.com/en/products/detail/koa-speer-electronics-inc/RK73B1JTTD472J/9844699; Composition: Thick Film; Device Package: 0603 (1608 Metric); Features: Automotive AEC-Q200; Height - Seated (Max): 0.022" (0.55mm); LastUpdated: 7/25/2024 9:43:10 AM; Lifecycle Status: Active; Minimum Order: 1; Number of Terminations: 2; Operating Temperature: -55°C ~ 155°C; Package / Case: 0603 (1608 Metric); Packaging: CutTape; PartId: 5830; Part Status: Active; Price: 0.01; Ratings: AEC-Q200; Series: RK73B; Size / Dimension: 0.063" L x 0.031" W (1.60mm x 0.80mm); Supplier 1: DigiKey; Supplier Part Number 1: 2019-RK73B1JTTD472JCT-ND; Supplier Device Package: 0603; Tolerance: ±5%

## Sheet GPS.SchDoc
size A4; SheetNumber: 1; SheetTotal: 2
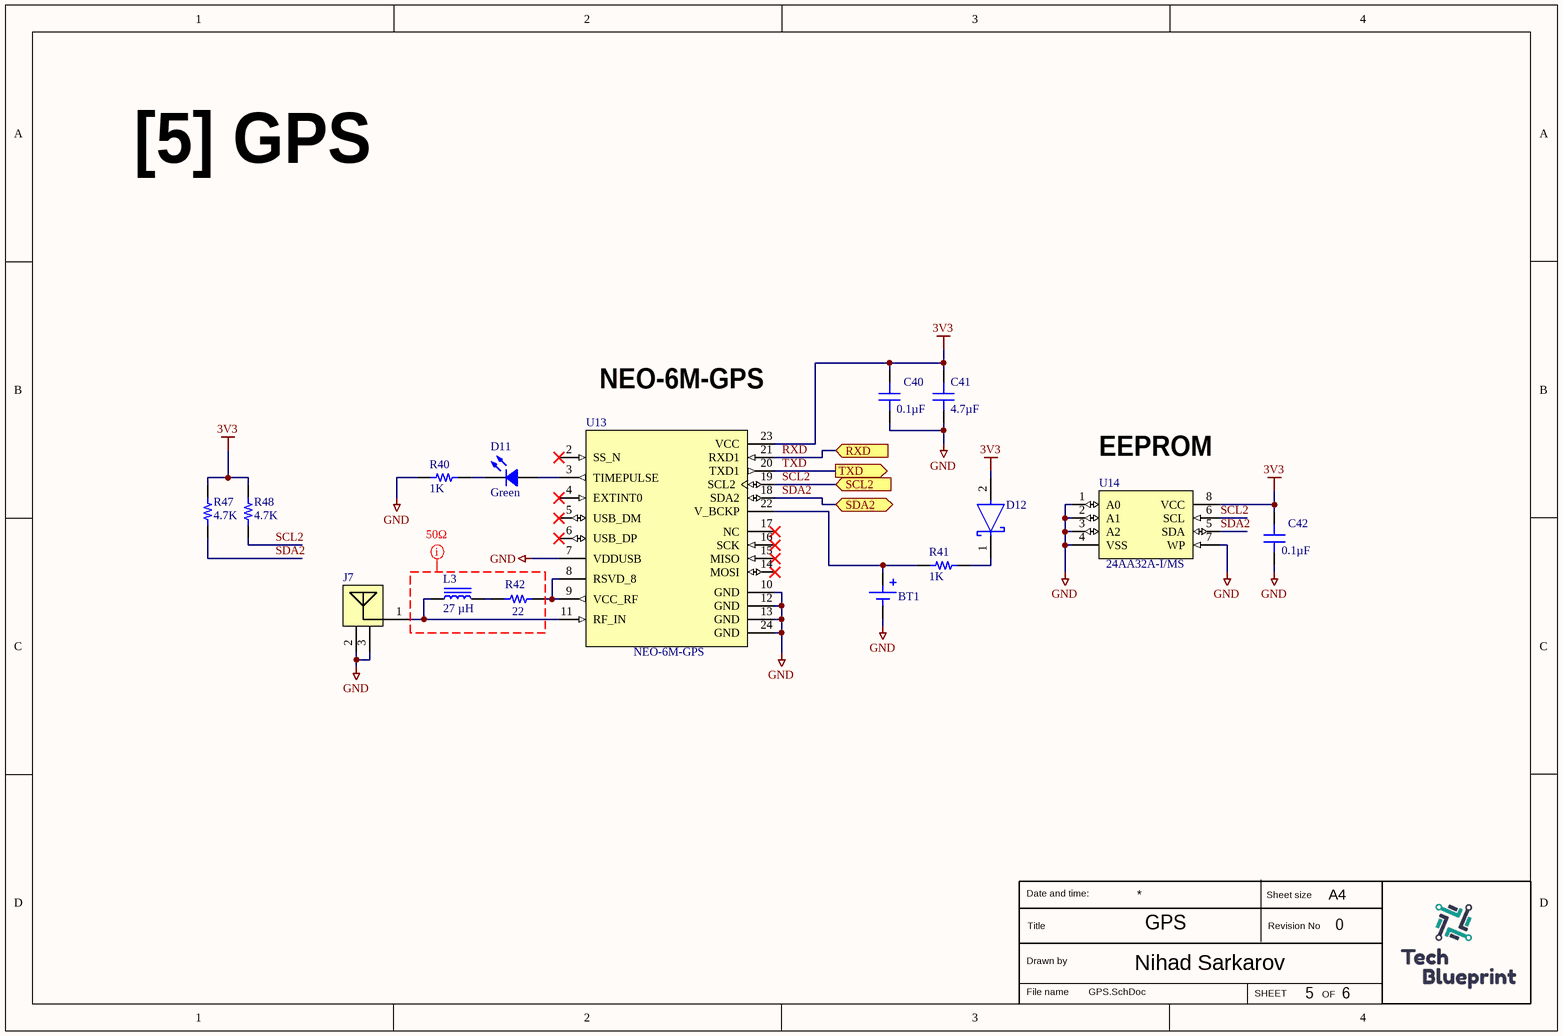
[diagram p3: GPS.SchDoc]

### Parts
BT1  MS621FE-FL11E  [BAT_MS621FE-FL11E]  (value not drawn)
C40  0.1µF  [CAP 0805_2012]
C41  4.7µF  [CAP 0805_2012]
C42  0.1µF  [CAP 0805_2012]
D11  Green  [LED 0603_1608 GREEN]
D12  B0530WS-7-F  [FP-SOD323-MFG]  (value not drawn)
J7  U.FL-R-SMT-1(10)  [FP-U_FL-R-SMT-1_10-MFG]  (value not drawn)
L3  27 µH  [TDK MLF1608]
R40  1K  [RES 0603_1608]
R41  1K  [RES 0805_2012]
R42  22  [RES 0603_1608]
R47  4.7K  [KOA RES RK73 RN73 0603_1608]
R48  4.7K  [KOA RES RK73 RN73 0603_1608]
U13  NEO-6M-GPS  [XCVR_NEO-6M-GPS]
U14  24AA32A-I/MS  [SOP65P490X110-8N]

### Ports
RXD (in, see MCU[7B]), SCL2 (in, see MCU[6B], Sensors[2D]), SDA2 (bidir, see MCU[6B], Sensors[2D]), TXD (out, see MCU[7B])

### Nets
3V3: C40.2 C41.2 C42.2 D12.2(A) R47.2 R48.2 U13.23(VCC) U14.8(VCC)
GND: BT1.NEG C40.1 C41.1 C42.1 J7.2(GND) J7.3(GND) R40.1 U13.7(VDDUSB) U13.10(GND) U13.12(GND) U13.13(GND) U13.24(GND) U14.1(A0) U14.2(A1) U14.3(A2) U14.4(VSS) U14.7(WP)
RXD: U13.21(RXD1) ; port RXD
SCL2: R48.1 U13.19(SCL2) U14.6(SCL) ; port SCL2
SDA2: R47.1 U13.18(SDA2) U14.5(SDA) ; port SDA2
TXD: U13.20(TXD1) ; port TXD
NetBT1_POS: BT1.POS R41.1 U13.22(V_BCKP)
NetD11_1: D11.1 U13.3(TIMEPULSE)
NetD11_2: D11.2 R40.2
NetD12_1: D12.1(C) R41.2
NetJ7_1: J7.1(SIG) L3.1 U13.11(RF_IN)
NetL3_2: L3.2 R42.1
NetR42_2: R42.2 U13.8(RSVD_8) U13.9(VCC_RF)

Not connected (* = marked no-connect by the designer): U13 2(SS_N)* 4(EXTINT0)* 5(USB_DM)* 6(USB_DP)* 14(MOSI)* 15(MISO)* 16(SCK)* 17(NC)*

### Layout directives
net class RF_50Ω: (no net found under the mark)

### Notes on the sheet
- [5] GPS
- (near U13) NEO-6M-GPS
- (near U14) EEPROM
- GPS
- 0
- 5
- 6
- Date and time:
- Title
- Sheet size
- Revision No
- A4
- Drawn by
- File name
- Nihad Sarkarov
- SHEET
- OF

### Library data of the parts
BT1 = MS621FE-FL11E: MF: {'manufacturer': u'Seiko Instruments'}; Package: None; Price: None; Value: *; MP: MS621FE-FL11E; Availability: Unavailable
C40 C42 = 08053C104KAT4A: as C2 on sheet MCU; Part Number: 08053C104KAT4A; Capacitance: 0.1µF; Applications: General Purpose; componentlink1description: Datasheet; componentlink1url: http://datasheets.avx.com/X7RDielectric.pdf; componentlink2description: DigiKey Link; componentlink2url: http://digikey.com/product-detail/en/avx-corporation/08053C104KAT4A/478-13052-1-ND/9948570; Device Package: 0805 (2012 Metric); lastupdated: 9/2/2020 1:04:37 AM; Lifecycle Status: Active; Minimum Order: 1; Mounting Type: Surface Mount, MLCC; Operating Temperature: -55°C ~ 125°C; Package / Case: 0805 (2012 Metric); packaging: TapeAndReel; partid: 5333; Part Status: Active; price: 0.02; series: -; Size / Dimension: 0.079" L x 0.049" W (2.01mm x 1.25mm); Supplier 1: DigiKey; Supplier Part Number 1: 478-13052-1-ND; Temperature Coefficient: X7R; Thickness (Max): 0.037" (0.94mm); value: 0.1µF; Voltage - Rated: 25V
C41 = 0805ZD475KAT2A: as C54 on sheet MCU; Part Number: 0805ZD475KAT2A; Capacitance: 4.7µF; Applications: General Purpose; componentlink1description: Datasheet; componentlink1url: http://datasheets.avx.com/cx5r.pdf; componentlink2description: DigiKey Link; componentlink2url: http://digikey.com/product-detail/en/avx-corporation/0805ZD475KAT2A/478-1415-1-ND/564447; Device Package: 0805 (2012 Metric); lastupdated: 9/2/2020 1:04:40 AM; Lifecycle Status: Active; Minimum Order: 1; Mounting Type: Surface Mount, MLCC; Operating Temperature: -55°C ~ 85°C; Package / Case: 0805 (2012 Metric); packaging: TapeAndReel; partid: 3139; Part Status: Active; price: 0.12; series: -; Size / Dimension: 0.079" L x 0.049" W (2.01mm x 1.25mm); Supplier 1: DigiKey; Supplier Part Number 1: 478-1415-1-ND; Temperature Coefficient: X5R; Thickness (Max): 0.055" (1.40mm); value: 4.7µF; Voltage - Rated: 10V
D11 = LSM0603453V: LED GREEN CLEAR CHIP 0603 SMD; Manufacturer: Visual Communications Company - VCC; Configuration: Standard; Current - Test: 20mA; Lens Color: Colorless; Lens Size: 1.20mm x 0.80mm; Lens Style: Rectangle with Flat Top; Millicandela Rating: 63mcd; Viewing Angle: 120°; Voltage - Forward (Vf) (Typ): 2V; Wavelength - Dominant: 572nm; Wavelength - Peak: 571nm; Part Number: LSM0603453V; Color: Green; ComponentLink1Description: Datasheet; ComponentLink1URL: https://vcclite.com/wp-content/uploads/wpallimport/files/files/LSM0603453V.pdf; ComponentLink2Description: DigiKey Link; ComponentLink2URL: https://www.digikey.com/en/products/detail/visual-communications-company-vcc/LSM0603453V/9486724; Device Package: 0603 (1608 Metric); Height (Max): 0.65mm; LastUpdated: 6/3/2024 7:58:54 PM; Lens Transparency: Clear; Lifecycle Status: Active; Minimum Order: 1; Mounting Type: Surface Mount; Package / Case: 0603 (1608 Metric); Packaging: TapeAndReel; PartId: 579; Part Status: Active; Price: 0.09; Series: LSM0603; Size / Dimension: 1.60mm L x 0.80mm W; Supplier 1: DigiKey; Supplier Part Number 1: LSM0603453VCT-ND; Supplier Device Package: Chip LED; Value: Green
D12 = CMP-12790-000023-1: DIODE SCHOTTKY 30V 500MA SOD323; Manufacturer: Diodes Inc.; Max Surge Forward Current: 2A; Forward Current: 0.5A; Automotive Grade: Grade 1; Max Junction Temp: +125°C; Standoff Height: 0.05mm; Peak Reverse Current: 500uA; Value: 58pF; Temperature Range Low: -40°C; Max Repetitive Reverse Voltage: 30V; Lead Free: Yes; Device Class L1: Discrete Semiconductors; RoHS: TRUE; Octopart: https://octopart.com/b0530ws-7-f-diodes+inc.-325723; Height: 1.2mm; Digikey Description: DIODE SCHOTTKY 30V 500MA SOD323; ComponentLink2URL: https://www.diodes.com/assets/Datasheets/ds30249.pdf; Device Class L2: Diodes; Reverse Voltage: 30V; Ipc Land Pattern Name: SOD250130X120-2; Footprint Url: https://www.diodes.com/assets/Package-Files/SOD323.pdf; Device Class L3: Schottky Diodes; Package: SOD323; ComponentLink2Description: Datasheet; Automotive: Yes; Temperature Range High: +125°C; Manufacturer Part Number: B0530WS-7-F; Category: Diode; Temperature: -40°C to +125°C; Mouser Description: Schottky Diodes & Rectifiers SCHOTTKY RECTIFIER; Capacitance: 58pF
J7 = CMP-2000-05152-3: CONN U.FL RCPT STR 50 OHM SMD; Max Frequency: 6GHz; Connector Type: Coaxial; Body Plating: Silver; Body Material: Bronze; Impedance: 50R; Dielectric Material: Polymer; Insulation Resistance: 500MR; Gender: Male; Packaging: Cut Tape; Length: 3mm; Package Quantity: 2500; Termination: Solder; Lead Free: Lead Free; Series: U.FL; Min Operating Temperature: -40°C; Fastening Type: Snap; Contact Material: Brass; Orientation: Straight; Wire/Cable Type: Coaxial; Frequency: 6GHz; Contact Plating: Gold; Depth: 3.1mm; Weight: 0.001764oz; Max Operating Temperature: 90°C; Radiation Hardening: No; REACH SVHC: No SVHC; Mount: Surface Mount; Housing Color: Beige
L3 = MLF1608C270KTD00: FIXED IND 27UH 2MA 1.8 OHM SMD; Manufacturer: TDK Corporation; DC Resistance (DCR): 1.8Ohm Max; Frequency - Self Resonant: 15MHz; Inductance Frequency - Test: 1 MHz; Material - Core: Ferrite; Q @ Freq: 20 @ 1MHz; Shielding: Shielded; Tolerance: ±10%; Type: Multilayer; Part Number: MLF1608C270KTD00; ComponentLink1Description: Datasheet; ComponentLink1URL: https://product.tdk.com/info/en/catalog/datasheets/inductor_commercial_standard_mlf1608_en.pdf?ref_disty=digikey; ComponentLink2Description: DigiKey Link; ComponentLink2URL: https://www.digikey.com/en/products/detail/tdk-corporation/MLF1608C270KTD00/504199; Current Rating (Amps): 2 mA; Device Package: 0603 (1608 Metric); Height - Seated (Max): 0.037" (0.95mm); Inductance: 27 µH; LastUpdated: 7/26/2024 2:55:23 PM; Lifecycle Status: Active; Minimum Order: 1; Mounting Type: Surface Mount; Operating Temperature: -40°C ~ 85°C; Package / Case: 0603 (1608 Metric); Packaging: TapeAndReel; PartId: 8154; Part Status: Active; Price: 0.04; Series: MLF; Size / Dimension: 0.063" L x 0.031" W (1.60mm x 0.80mm); Supplier 1: DigiKey; Supplier Part Number 1: 445-1030-1-ND; Supplier Device Package: 0603 (1608 Metric); Value: 27 µH
R40 = RMCF0603JT1K00: RES 1K OHM 5% 1/10W 0603; Manufacturer: Stackpole Electronics Inc; Power (Watts): 0.1W, 1/10W; Resistance: 1 kOhms; Temperature Coefficient: ±200ppm/°C; Part Number: RMCF0603JT1K00; Value: 1K; ComponentLink1Description: Datasheet; ComponentLink1URL: https://www.seielect.com/catalog/sei-rmcf_rmcp.pdf; ComponentLink2Description: DigiKey Link; ComponentLink2URL: https://www.digikey.com/en/products/detail/stackpole-electronics-inc/RMCF0603JT1K00/1758057; Composition: Thick Film; Device Package: 0603 (1608 Metric); Features: Automotive AEC-Q200; Height - Seated (Max): 0.022" (0.55mm); LastUpdated: 2/9/2024 8:43:33 PM; Lifecycle Status: Active; Minimum Order: 1; Number of Terminations: 2; Operating Temperature: -55°C ~ 155°C; Package / Case: 0603 (1608 Metric); Packaging: CutTape; PartId: 5824; Part Status: Active; Price: 0.01; Ratings: AEC-Q200; Series: RMCF; Size / Dimension: 0.061" L x 0.031" W (1.55mm x 0.80mm); Supplier 1: DigiKey; Supplier Part Number 1: RMCF0603JT1K00CT-ND; Supplier Device Package: 0603; Tolerance: ±5%
R41 = CRGH0805J1K0: as R2 on sheet MCU; Part Number: CRGH0805J1K0; Value: 1K; ComponentLink1Description: Datasheet; ComponentLink1URL: https://www.te.com/commerce/DocumentDelivery/DDEController?Action=srchrtrv&DocNm=1773204-1&DocType=DS&DocLang=English; ComponentLink2Description: DigiKey Link; ComponentLink2URL: https://www.digikey.com/en/products/detail/te-connectivity-passive-product/CRGH0805J1K0/2385524; Composition: Thick Film; Device Package: 0805 (2012 Metric); LastUpdated: 2/8/2024 9:02:37 PM; Lifecycle Status: Active; Minimum Order: 1; Number of Terminations: 2; Operating Temperature: -55°C ~ 155°C; Package / Case: 0805 (2012 Metric); Packaging: TapeAndReel; PartId: 28125; Part Status: Active; Price: 0.01; Series: CRGH, Neohm; Size / Dimension: 0.083" L x 0.051" W (2.10mm x 1.30mm); Supplier 1: DigiKey; Supplier Part Number 1: A126435CT-ND; Supplier Device Package: 0805; Tolerance: ±5%
R42 = ERJ-3EKF22R0V: RES SMD 22 OHM 1% 1/10W 0603; Manufacturer: Panasonic Electronic Components; Power (Watts): 0.1W, 1/10W; Resistance: 22 Ohms; Temperature Coefficient: ±100ppm/°C; Part Number: ERJ-3EKF22R0V; Value: 22; ComponentLink1Description: Datasheet; ComponentLink1URL: https://industrial.panasonic.com/cdbs/www-data/pdf/RDA0000/AOA0000C304.pdf; ComponentLink2Description: DigiKey Link; ComponentLink2URL: https://www.digikey.com/en/products/detail/panasonic-electronic-components/ERJ-3EKF22R0V/1746340; Composition: Thick Film; Device Package: 0603 (1608 Metric); Features: Automotive AEC-Q200; Height - Seated (Max): 0.022" (0.55mm); LastUpdated: 2/9/2024 8:43:34 PM; Lifecycle Status: Active; Minimum Order: 1; Number of Terminations: 2; Operating Temperature: -55°C ~ 155°C; Package / Case: 0603 (1608 Metric); Packaging: TapeAndReel; PartId: 5655; Part Status: Active; Price: 0.01; Ratings: AEC-Q200; Series: ERJ-3EK; Size / Dimension: 0.063" L x 0.031" W (1.60mm x 0.80mm); Supplier 1: DigiKey; Supplier Part Number 1: P22.0HCT-ND; Supplier Device Package: 0603; Tolerance: ±1%
R47 R48 = RK73B1JTTD472J: as R50 on sheet Lora; Part Number: RK73B1JTTD472J; Value: 4.7K; ComponentLink1Description: Datasheet; ComponentLink1URL: http://www.koaspeer.com/catimages/Products/RK73B/RK73B.pdf; ComponentLink2Description: DigiKey Link; ComponentLink2URL: https://www.digikey.com/en/products/detail/koa-speer-electronics-inc/RK73B1JTTD472J/9844699; Composition: Thick Film; Device Package: 0603 (1608 Metric); Features: Automotive AEC-Q200; Height - Seated (Max): 0.022" (0.55mm); LastUpdated: 7/25/2024 9:43:10 AM; Lifecycle Status: Active; Minimum Order: 1; Number of Terminations: 2; Operating Temperature: -55°C ~ 155°C; Package / Case: 0603 (1608 Metric); Packaging: CutTape; PartId: 5830; Part Status: Active; Price: 0.01; Ratings: AEC-Q200; Series: RK73B; Size / Dimension: 0.063" L x 0.031" W (1.60mm x 0.80mm); Supplier 1: DigiKey; Supplier Part Number 1: 2019-RK73B1JTTD472JCT-ND; Supplier Device Package: 0603; Tolerance: ±5%
U13 = NEO-6M-GPS: MF: {'manufacturer': u'u-blox'}; Package: None; Price: None; Value: *; MP: NEO-6M-GPS; Availability: Unavailable
U14 = 24AA32A-I/MS: MF: {'manufacturer': u'Microchip Technology'}; Package: None; Price: None; Value: *; MP: 24AA32A-I/MS; Availability: Unavailable

## Sheet Power.SchDoc
size A3; SheetNumber: 6; SheetTotal: 6
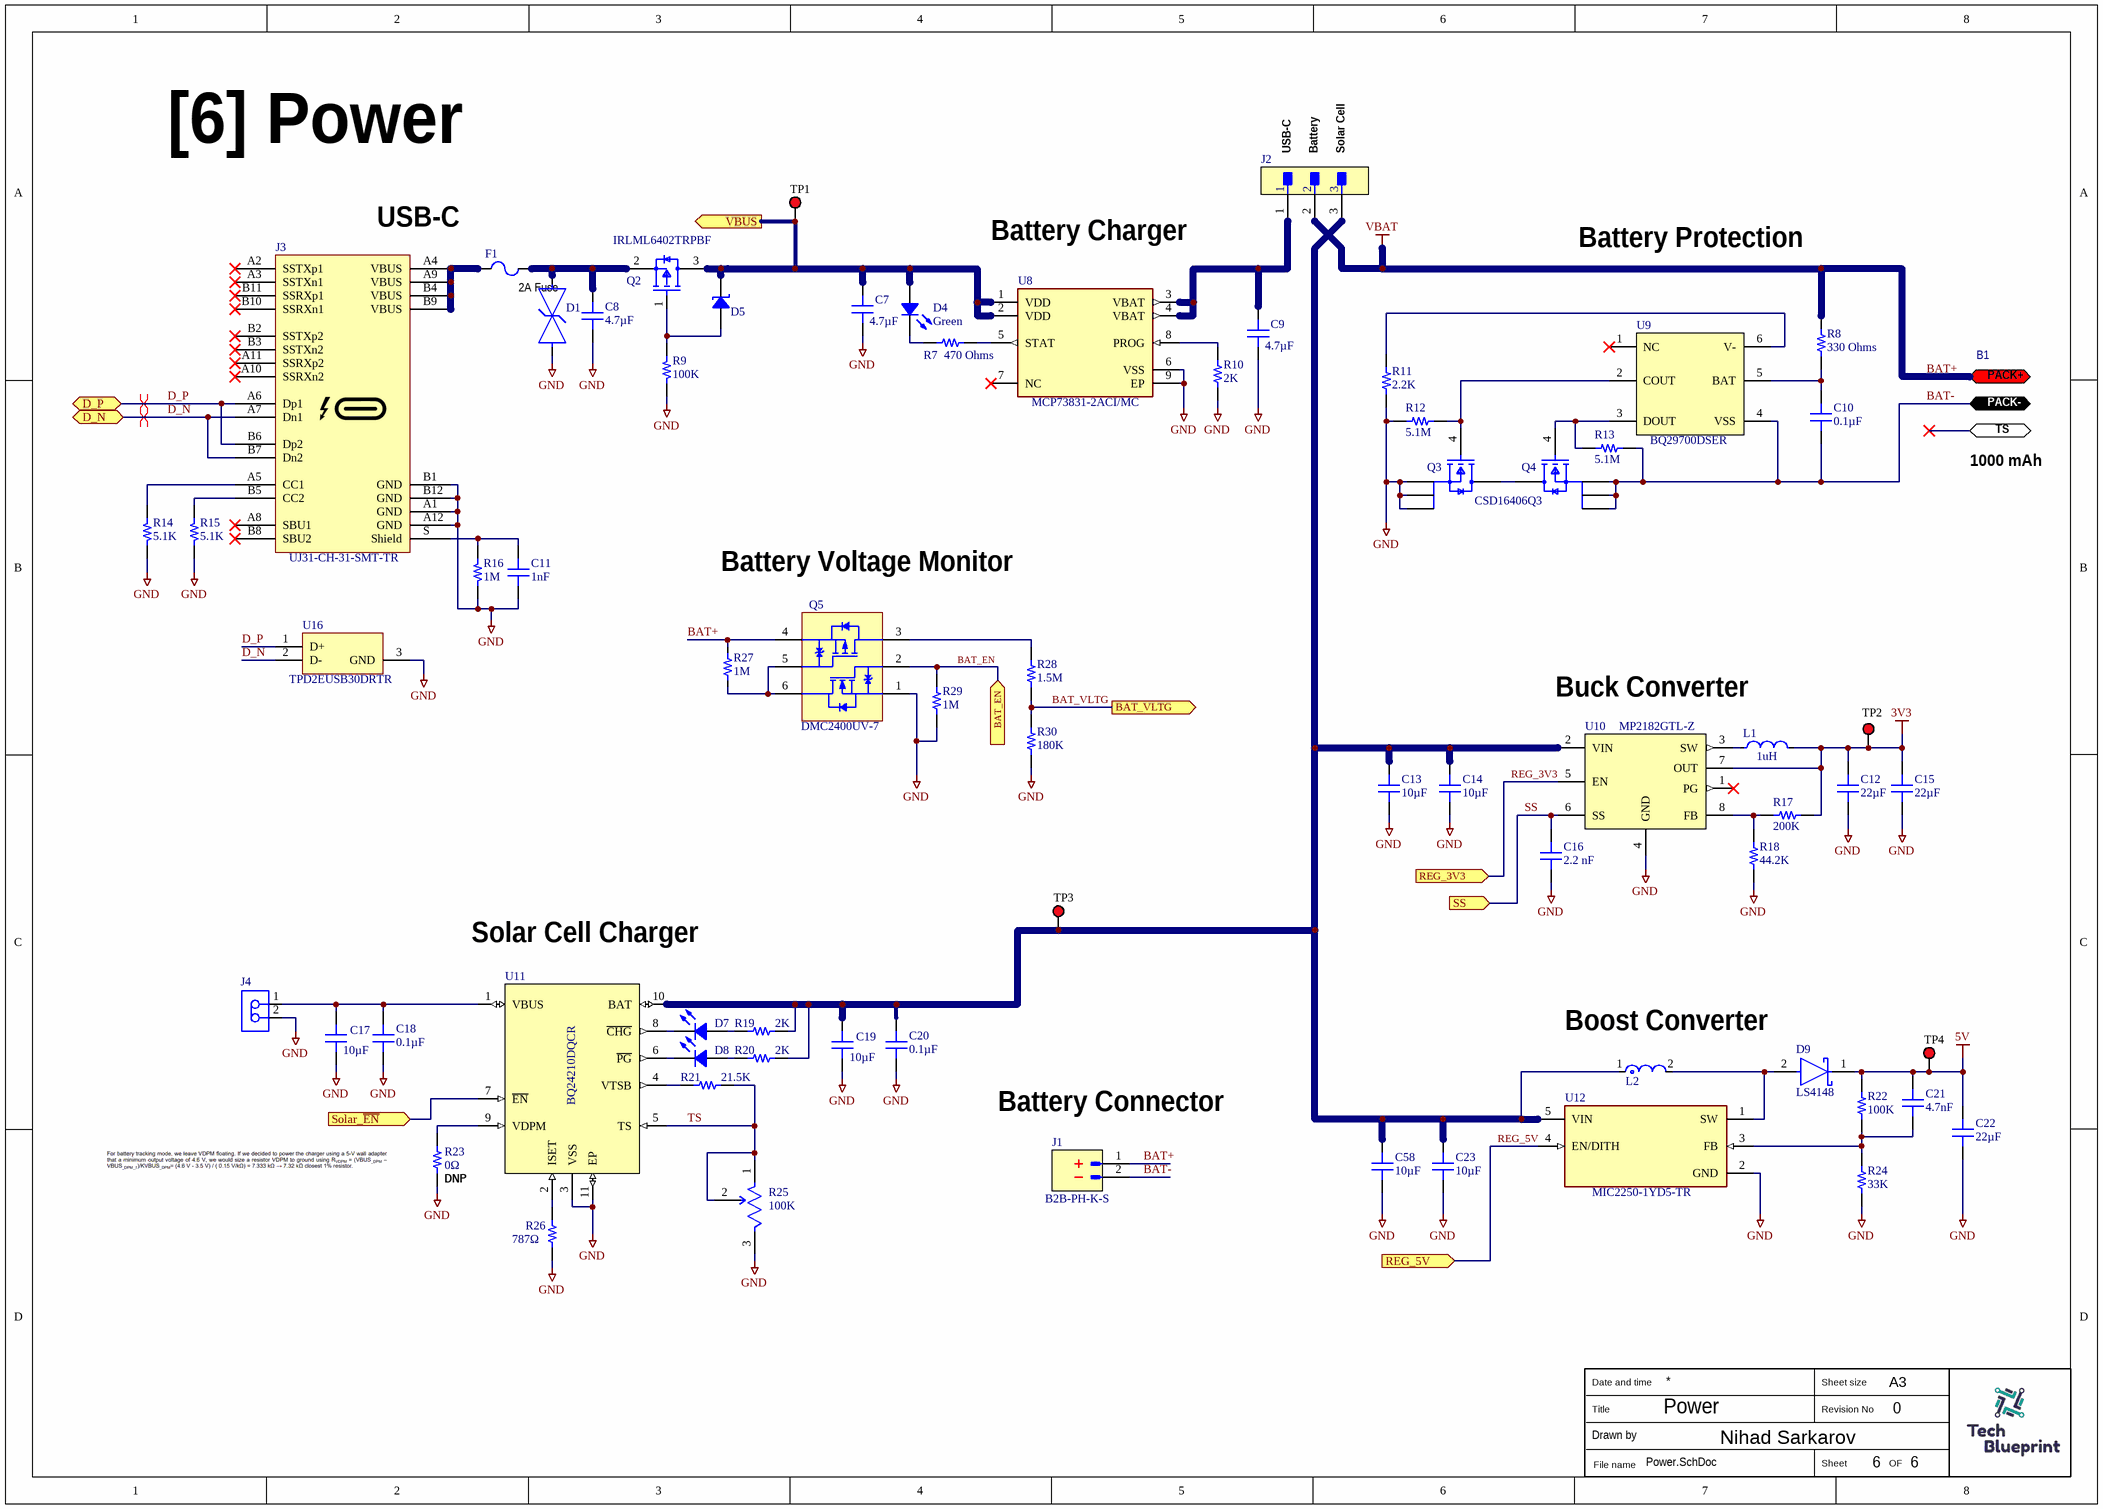
[diagram p4: Power.SchDoc]

### Parts
B1  Battery  [1000 mAh battery]  (value not drawn)
C7  4.7µF  [CAP 0805_2012]
C8  4.7µF  [CAP 0805_2012]
C9  4.7µF  [CAP 0805_2012]
C10  0.1µF  [CAP 0805_2012]
C11  Capacitance: 1nF  [CAP 0805_2012]  (hidden comment: 1000 pF)
C12  22µF  [CAP 0805_2012]
C13  10µF  [CAP 0805_2012]
C14  10µF  [CAP 0805_2012]
C15  22µF  [CAP 0805_2012]
C16  Capacitance: 2.2 nF  [CAP 0603_1608]  (hidden comment: 2200 pF)
C17  10µF  [CAP 0805_2012]
C18  0.1µF  [CAP 0805_2012]
C19  10µF  [CAP 0805_2012]
C20  0.1µF  [CAP 0805_2012]
C21  Capacitance: 4.7nF  [CAP 0603_1608]  (hidden comment: 4700 pF)
C22  22µF  [CAP 0805_2012]
C23  10µF  [CAP 0805_2012]
C58  10µF  [CAP 0805_2012]
D1  EZA-EG3A50AV  [FP-EZAEG3A-MFG]  (value not drawn)
D4  Green  [LED 0603_1608 GREEN]
D5  PZU3.0B2A,115  [SOD323]  (value not drawn)
D7  Red  [LED 0603_1608 RED]  (value not drawn)
D8  Green  [LED 0603_1608 GREEN]  (value not drawn)
D9  LS4148  [FP-6_560-5006_01-4-MFG]
F1  3413.0219.22  [FUSE 1206_3216 0.6MM]  (value not drawn)
J1  B2B-PH-K-S  [JST_B2B-PH-K-S]
J2  87224-3  [FP-87224-3-MFG]  (value not drawn)
J3  UJ31-CH-31-SMT-TR  [CUI UJ31-CH-31-SMT-TR]
J4  640456-2  [TECO-640456-2_V]  (value not drawn)
L1  Inductance: 1uH  [FP-DFE252012C-IPC_C]  (hidden comment: 1239AS-H-1R0M=P2)
L2  LPS4018-104MRB  [FP-LPS4018-MFG]  (value not drawn)
Q2  IRLML6402TRPBF  [FP-Micro3-MFG]
Q3  CSD16406Q3  [FP-DQG0008A-MFG]  (value not drawn)
Q4  CSD16406Q3  [FP-DQG0008A-MFG]
Q5  DMC2400UV-7  [DIOD-SOT563-6_V]
R7  470 Ohms  [RES 0603_1608]
R8  330 Ohms  [RES 0805_2012]
R9  100K  [RES 0805_2012]
R10  2K  [YAGEO RES 0603_1608]
R11  2.2K  [RES 0805_2012]
R12  5.1M  [RES 0805_2012]
R13  5.1M  [RES 0805_2012]
R14  5.1K  [YAGEO RES RK73 RS73 SG73 0805_2012]
R15  5.1K  [YAGEO RES RK73 RS73 SG73 0805_2012]
R16  1M  [RES 0805_2012]
R17  200K  [YAGEO RES 0805_2012]
R18  44.2K  [YAGEO RES RK73 RS73 SG73 0805_2012]
R19  2K  [RES 0603_1608]
R20  2K  [RES 0603_1608]
R21  21.5K  [RES 0805_2012]
R22  100K  [RES 0805_2012]
R23  0Ω  [RES 0805_2012]
R24  33K  [RES 0805_2012]
R25  Resistance: 100K  [FP-TC33X-2-MFG]  (hidden comment: TC33X-2-104E)
R26  787Ω  [RES 0805_2012]
R27  1M  [RES 0805_2012]
R28  1.5M  [RES 0805_2012]
R29  1M  [RES 0805_2012]
R30  180K  [RES 0805_2012]
TP1  5010  [KSTN-5010_V]  (value not drawn)
TP2  5010  [KSTN-5010_V]  (value not drawn)
TP3  5010  [KSTN-5010_V]  (value not drawn)
TP4  5010  [KSTN-5010_V]  (value not drawn)
U8  MCP73831-2ACI/MC  [FP-C04-123-MFG]
U9  BQ29700DSER  [FP-DSE0006A-IPC_A]
U10  MP2182GTL-Z  [SOT583_MP2182_MNP]
U11  BQ24210DQCR  [SON50P300X200X80-11N]
U12  MIC2250-1YD5-TR  [FP-MIC2250-1YD5-TR-IPC_C]
U16  TPD2EUSB30DRTR  [DRT0003A]

### Ports
BAT_EN (in, see MCU[4C]), BAT_VLTG (out, see MCU[4C]), D_N (bidir, see MCU[1C]), D_P (bidir, see MCU[1C]), REG_3V3 (in, see MCU[6B]), REG_5V (in, see MCU[6B]), Solar_~{EN} (in, see MCU[4C]), SS (in, see MCU[4A]), VBUS (out, see MCU[2C])

### Nets
3V3: C12.2 C15.2 L1.2 R17.1 TP2.1 U10.7(OUT)
5V: C21.2 C22.2 D9.1(C) R22.2 TP4.1
BAT+: B1.?1 J1.1 J2.2 Q5.4(S2) R8.2 R27.1  [also labelled VBAT]
GND: C7.1 C8.1 C9.1 C11.1 C12.1 C13.1 C14.1 C15.1 C16.1 C17.1 C18.1 C19.1 C20.1 C22.1 C23.1 C58.1 D1.1 J3.A1(GND) J3.A12(GND) J3.B1(GND) J3.B12(GND) J4.2 Q3.1(S) Q3.2(S) Q3.3(S) Q5.1(S1) R9.1 R10.1 R11.1 R12.1 R14.1 R15.1 R16.1 R18.1 R23.1 R24.1 R25.3(CW) R26.1 R29.2 R30.1 U8.6(VSS) U8.9(EP) U10.4(GND) U11.3(VSS) U11.11(EP) U12.2(GND) U16.3(GND)
BAT-: B1.?2 C10.1 J1.2 Q4.1(S) Q4.2(S) Q4.3(S) R13.2 U9.4(VSS)
BAT_EN: Q5.2(G1) R29.1 ; port BAT_EN
BAT_VLTG: R28.1 R30.2 ; port BAT_VLTG
D_N: J3.A7(Dn1) J3.B7(Dn2) U16.2(D-) ; port D_N
D_P: J3.A6(Dp1) J3.B6(Dp2) U16.1(D+) ; port D_P
REG_3V3: U10.5(EN) ; port REG_3V3
REG_5V: U12.4(EN/DITH) ; port REG_5V
Solar_~{EN}: U11.7(~{EN}) ; port Solar_~{EN}
SS: C16.2 U10.6(SS) ; port SS
TS: R21.1 R25.1(CCW) R25.2(WIPER) U11.5(TS)
VBUS: C7.2 D4.1 D5.2 Q2.3(D) TP1.1 U8.1(VDD) U8.2(VDD) ; port VBUS
NetC8_2: C8.2 D1.2 F1.1 Q2.2(S)
NetC9_2: C9.2 J2.1 U8.3(VBAT) U8.4(VBAT)
NetC10_2: C10.2 R8.1 U9.5(BAT)
NetC11_2: C11.2 J3.S(Shield) R16.2
NetC13_2: C13.2 C14.2 C19.2 C20.2 C23.2 C58.2 J2.3 L2.1 R19.2 R20.2 TP3.1 U10.2(VIN) U11.10(BAT) U12.5(VIN)
NetC17_2: C17.2 C18.2 J4.1 U11.1(VBUS)
NetC21_1: C21.1 R22.1 R24.2 U12.3(FB)
NetD4_2: D4.2 R7.1
NetD5_1: D5.1 Q2.1(G) R9.2
NetD7_1: D7.1 R19.1
NetD7_2: D7.2 U11.8(~{CHG})
NetD8_1: D8.1 R20.1
NetD8_2: D8.2 U11.6(~{PG})
NetD9_2: D9.2(A) L2.2 U12.1(SW)
NetF1_2: F1.2 J3.A4(VBUS) J3.A9(VBUS) J3.B4(VBUS) J3.B9(VBUS)
NetJ3_A5: J3.A5(CC1) R14.2
NetJ3_B5: J3.B5(CC2) R15.2
NetL1_1: L1.1 U10.3(SW)
NetQ3_4: Q3.4(G) R12.2 U9.2(COUT)
NetQ3_5-6-7-8: Q3.5-6-7-8(D) Q4.5-6-7-8(D)
NetQ4_4: Q4.4(G) R13.1 U9.3(DOUT)
NetQ5_3: Q5.3(D2) R28.2
NetQ5_5: Q5.5(G2) Q5.6(D1) R27.2
NetR7_2: R7.2 U8.5(STAT)
NetR10_2: R10.2 U8.8(PROG)
NetR11_2: R11.2 U9.6(V-)
NetR17_2: R17.2 R18.2 U10.8(FB)
NetR21_2: R21.2 U11.4(VTSB)
NetR23_2: R23.2 U11.9(VDPM)
NetR26_2: R26.2 U11.2(ISET)

Not connected (* = marked no-connect by the designer): B1 ?3*; J3 A2(SSTXp1)* A3(SSTXn1)* A8(SBU1)* A10(SSRXn2)* A11(SSRXp2)* B2(SSTXp2)* B3(SSTXn2)* B8(SBU2)* B10(SSRXn1)* B11(SSRXp1)*; U8 7(NC)*; U9 1(NC)*; U10 1(PG)*

### Layout directives
differential pair; differential pair class USB_90: D_N, D_P